# Altium project BTF16_2.PrjPcb (part 1 of 2)
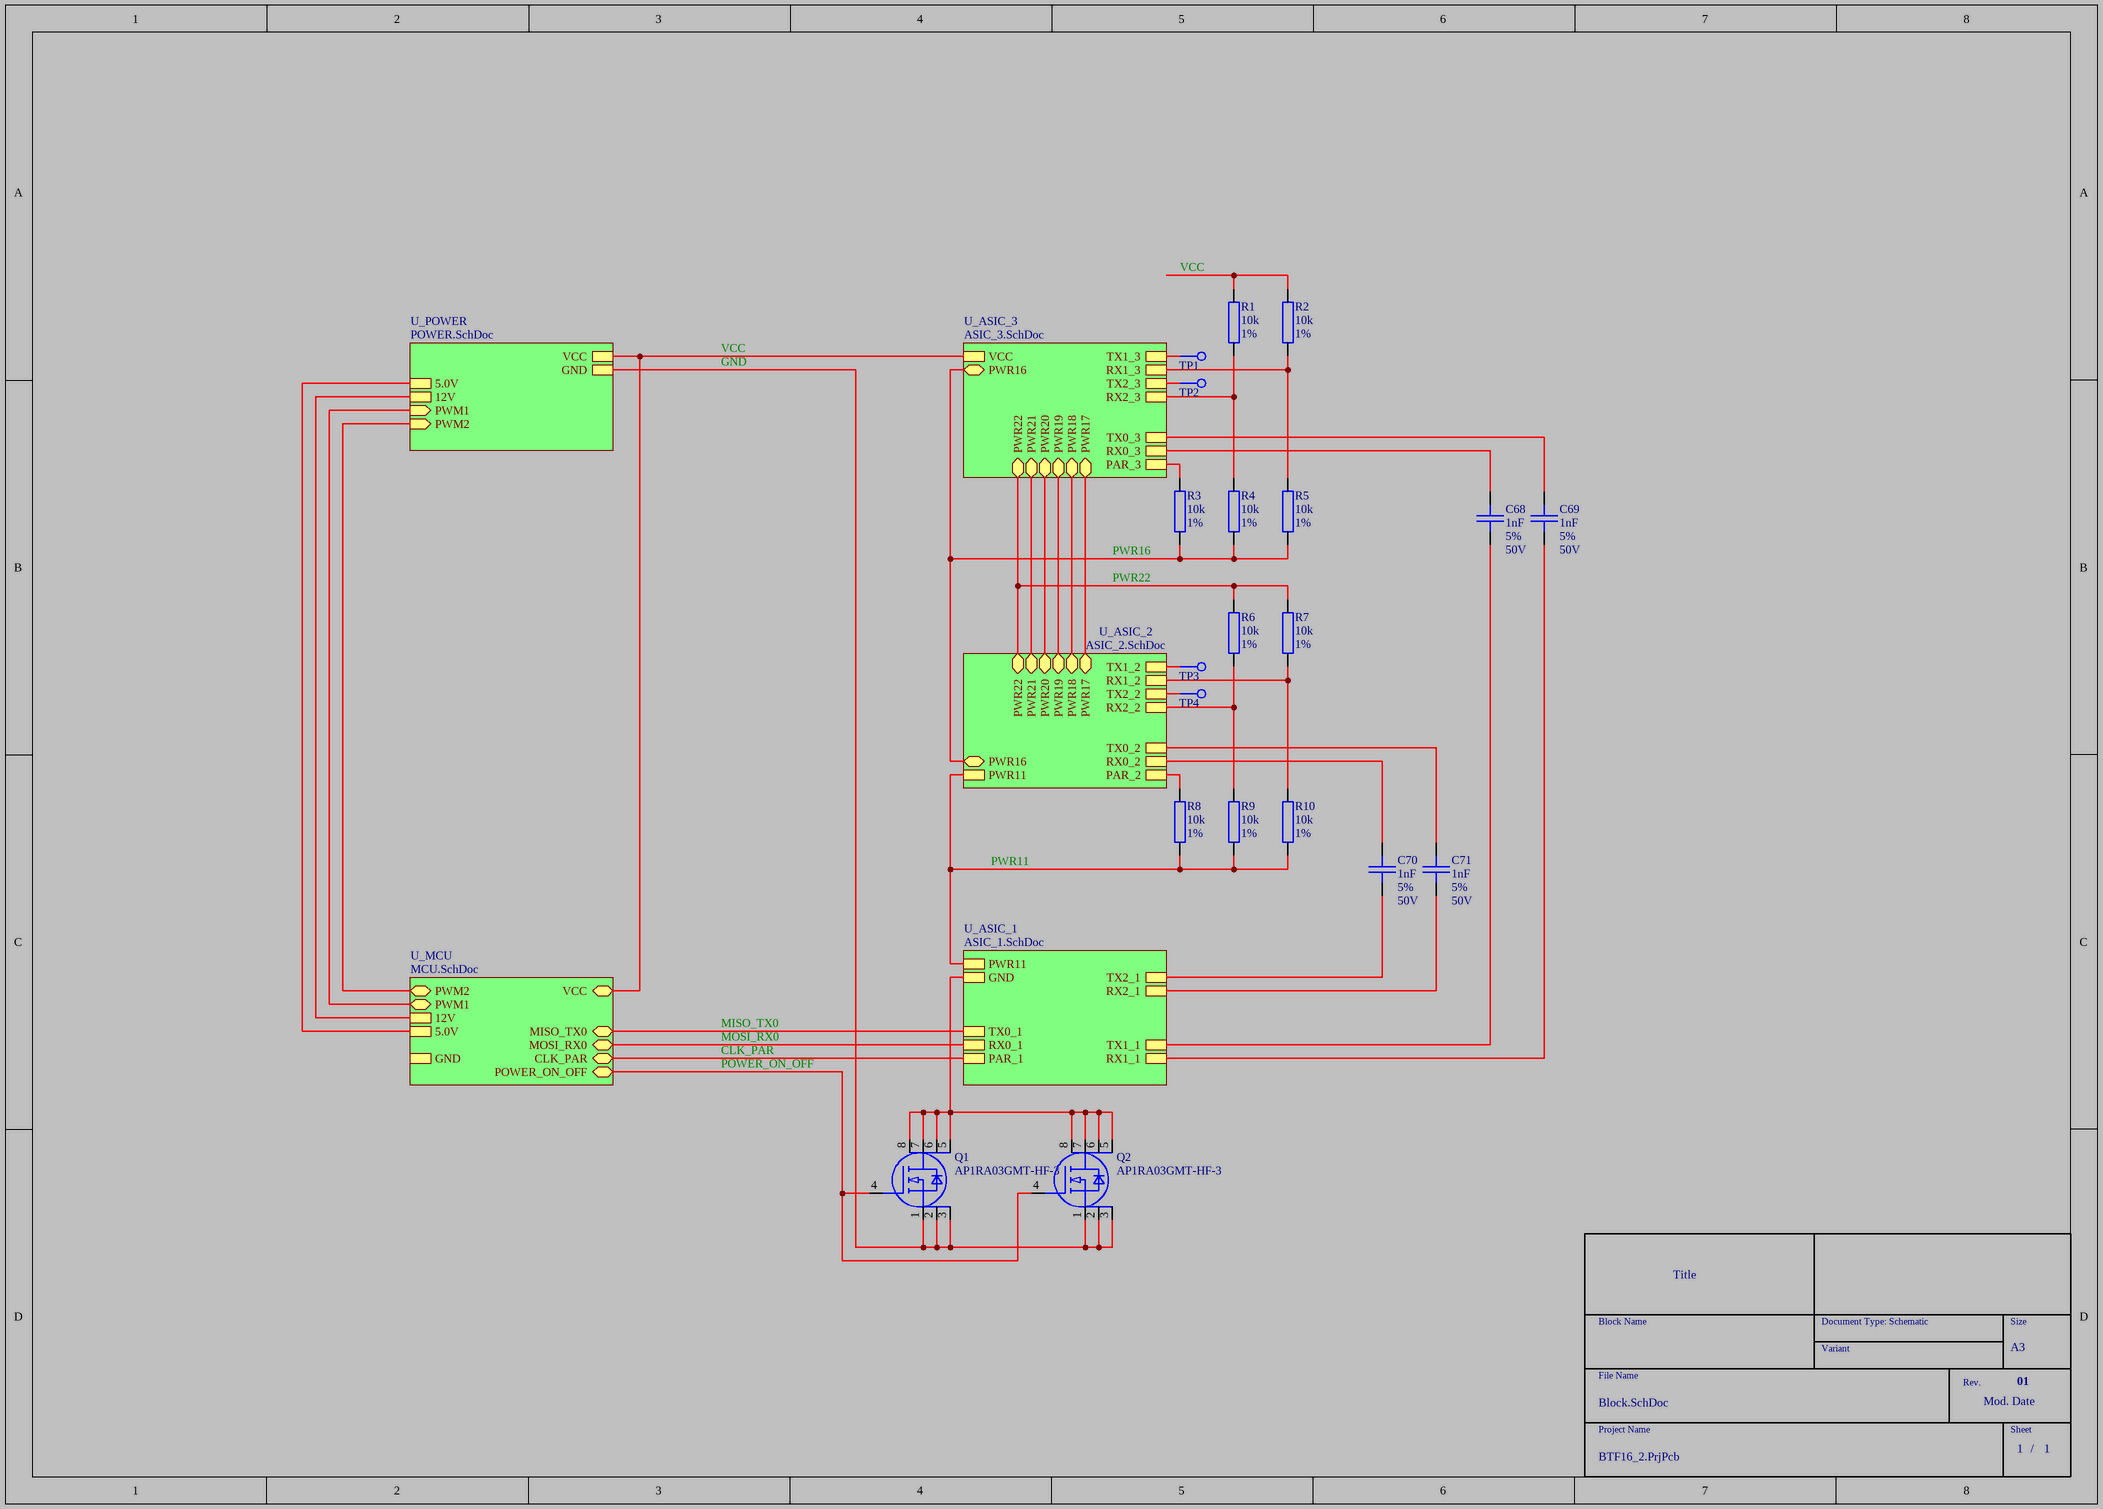
[diagram p0: Block.SchDoc]
6 sheets, 273 parts. Net scope: strictly hierarchical (ports join the sheet entries above them; power ports are local).
Board file: BTF16_2.PcbDoc
Sheets:
  Block.SchDoc
    U_MCU = MCU.SchDoc
    U_ASIC_1 = ASIC_1.SchDoc
    U_ASIC_2 = ASIC_2.SchDoc
    U_ASIC_3 = ASIC_3.SchDoc
    U_POWER = POWER.SchDoc

## Sheet Block.SchDoc: Title
size A3; Date: Date; CompanyName: Integrated Micro-Electronics Bulgaria; Organization: Design & Development Department; Address1: Drawing Type; Address2: Address 1; Address3: Address 2; Address4: Address 3; DocumentNumber: 730xxx; Revision: 01; SheetNumber: 1; SheetTotal: 1; PageSetup: Record=PageOptions|CenterHorizontal=True|CenterVertical=True|PrintScale=0.70|XCorrection=1.00|YCorrection=1.00|PrintKind=2|BorderSize=5000000|LeftOffset=0|BottomOffset=0|Orientation=2|PaperLength=1000|PaperWidth=1000|Scale=100|PaperSource=7|PrintQuality=-4|MediaType=1|DitherType=10|PaperKind=A4|PrintScaleMode=1; SheetSize: A3; Time: Time; ModifiedDate: Mod. Date

### Parts
C68  DB_VALUE: 1nF  DB_TOLERANCE: 5%  DB_VOLTAGE: 50V  [SMD_0603_CAPC1608X95N]  (hidden comment: C)
C69  DB_VALUE: 1nF  DB_TOLERANCE: 5%  DB_VOLTAGE: 50V  [SMD_0603_CAPC1608X95N]  (hidden comment: C)
C70  DB_VALUE: 1nF  DB_TOLERANCE: 5%  DB_VOLTAGE: 50V  [SMD_0603_CAPC1608X95N]  (hidden comment: C)
C71  DB_VALUE: 1nF  DB_TOLERANCE: 5%  DB_VOLTAGE: 50V  [SMD_0603_CAPC1608X95N]  (hidden comment: C)
Q1  DB_VALUE: AP1RA03GMT-HF-3  [SMD_SOIC127P600X110-9AN]  (hidden comment: MOS_N_D1_S1S2S3G4D5D6D7D8)
Q2  DB_VALUE: AP1RA03GMT-HF-3  [SMD_SOIC127P600X110-9AN]  (hidden comment: MOS_N_D1_S1S2S3G4D5D6D7D8)
R1  DB_VALUE: 10k  DB_TOLERANCE: 1%  [SMD_0603_RESC1608X55N]  (hidden comment: R)
R2  DB_VALUE: 10k  DB_TOLERANCE: 1%  [SMD_0603_RESC1608X55N]  (hidden comment: R)
R3  DB_VALUE: 10k  DB_TOLERANCE: 1%  [SMD_0603_RESC1608X55N]  (hidden comment: R)
R4  DB_VALUE: 10k  DB_TOLERANCE: 1%  [SMD_0603_RESC1608X55N]  (hidden comment: R)
R5  DB_VALUE: 10k  DB_TOLERANCE: 1%  [SMD_0603_RESC1608X55N]  (hidden comment: R)
R6  DB_VALUE: 10k  DB_TOLERANCE: 1%  [SMD_0603_RESC1608X55N]  (hidden comment: R)
R7  DB_VALUE: 10k  DB_TOLERANCE: 1%  [SMD_0603_RESC1608X55N]  (hidden comment: R)
R8  DB_VALUE: 10k  DB_TOLERANCE: 1%  [SMD_0603_RESC1608X55N]  (hidden comment: R)
R9  DB_VALUE: 10k  DB_TOLERANCE: 1%  [SMD_0603_RESC1608X55N]  (hidden comment: R)
R10  DB_VALUE: 10k  DB_TOLERANCE: 1%  [SMD_0603_RESC1608X55N]  (hidden comment: R)
TP1  TEST_POINT_1  [SMD_TP_100-254]  (value not drawn)
TP2  TEST_POINT_1  [SMD_TP_100-254]  (value not drawn)
TP3  TEST_POINT_1  [SMD_TP_100-254]  (value not drawn)
TP4  TEST_POINT_1  [SMD_TP_100-254]  (value not drawn)

### Sub-sheets
U_ASIC_1 = ASIC_1.SchDoc: PWR11, GND, PAR_1, TX0_1, RX0_1, TX1_1, RX1_1, TX2_1, RX2_1
U_ASIC_2 = ASIC_2.SchDoc: PWR11, PAR_2, TX0_2, RX0_2, TX1_2, RX1_2, TX2_2, RX2_2, PWR16, PWR22, PWR17, PWR18, PWR19, PWR20, PWR21
U_ASIC_3 = ASIC_3.SchDoc: VCC, PAR_3, TX0_3, RX0_3, TX1_3, RX1_3, TX2_3, RX2_3, PWR16, PWR17, PWR18, PWR19, PWR20, PWR21, PWR22
U_MCU = MCU.SchDoc: GND, 12V, 5.0V, MOSI_RX0, MISO_TX0, CLK_PAR, POWER_ON_OFF, PWM1, PWM2, VCC
U_POWER = POWER.SchDoc: VCC, GND, 5.0V, 12V, PWM1 (in), PWM2 (in)

### Nets
GND: Q1.1(S) Q1.2(S) Q1.3(S) Q2.1(S) Q2.2(S) Q2.3(S) ; sheet U_POWER/GND
5.0V: sheet U_MCU/5.0V, sheet U_POWER/5.0V
12V: sheet U_MCU/12V, sheet U_POWER/12V
CLK_PAR: sheet U_MCU/CLK_PAR, sheet U_ASIC_1/PAR_1
GND: Q1.5(D) Q1.6(D) Q1.7(D) Q1.8(D) Q2.5(D) Q2.6(D) Q2.7(D) Q2.8(D) ; sheet U_ASIC_1/GND  [a separate net that carries the same name]
MISO_TX0: sheet U_MCU/MISO_TX0, sheet U_ASIC_1/TX0_1
MOSI_RX0: sheet U_MCU/MOSI_RX0, sheet U_ASIC_1/RX0_1
PAR_2: R8.1 ; sheet U_ASIC_2/PAR_2
PAR_3: R3.1 ; sheet U_ASIC_3/PAR_3
POWER_ON_OFF: Q1.4(G) Q2.4(G) ; sheet U_MCU/POWER_ON_OFF
PWM1: sheet U_MCU/PWM1, sheet U_POWER/PWM1
PWM2: sheet U_MCU/PWM2, sheet U_POWER/PWM2
PWR11: R8.2 R9.2 R10.2 ; sheet U_ASIC_1/PWR11, sheet U_ASIC_2/PWR11
PWR16: R3.2 R4.2 R5.2 ; sheet U_ASIC_2/PWR16, sheet U_ASIC_3/PWR16
PWR17: sheet U_ASIC_2/PWR17, sheet U_ASIC_3/PWR17
PWR18: sheet U_ASIC_2/PWR18, sheet U_ASIC_3/PWR18
PWR19: sheet U_ASIC_2/PWR19, sheet U_ASIC_3/PWR19
PWR20: sheet U_ASIC_2/PWR20, sheet U_ASIC_3/PWR20
PWR21: sheet U_ASIC_2/PWR21, sheet U_ASIC_3/PWR21
PWR22: R6.2 R7.2 ; sheet U_ASIC_2/PWR22, sheet U_ASIC_3/PWR22
RX0_2: C70.1 ; sheet U_ASIC_2/RX0_2
RX0_3: C68.1 ; sheet U_ASIC_3/RX0_3
RX1_1: C69.2 ; sheet U_ASIC_1/RX1_1
RX1_2: R7.1 R10.1 ; sheet U_ASIC_2/RX1_2
RX1_3: R2.1 R5.1 ; sheet U_ASIC_3/RX1_3
RX2_1: C71.2 ; sheet U_ASIC_1/RX2_1
RX2_2: R6.1 R9.1 ; sheet U_ASIC_2/RX2_2
RX2_3: R1.1 R4.1 ; sheet U_ASIC_3/RX2_3
TX0_2: C71.1 ; sheet U_ASIC_2/TX0_2
TX0_3: C69.1 ; sheet U_ASIC_3/TX0_3
TX1_1: C68.2 ; sheet U_ASIC_1/TX1_1
TX1_2: TP3.1 ; sheet U_ASIC_2/TX1_2
TX1_3: TP1.1 ; sheet U_ASIC_3/TX1_3
TX2_1: C70.2 ; sheet U_ASIC_1/TX2_1
TX2_2: TP4.1 ; sheet U_ASIC_2/TX2_2
TX2_3: TP2.1 ; sheet U_ASIC_3/TX2_3
VCC: R1.2 R2.2 ; sheet U_MCU/VCC, sheet U_ASIC_3/VCC, sheet U_POWER/VCC

### Notes on the sheet
- Block Name
- Document Type: Schematic
- Size
- File Name
- Variant
- Rev.
- Project Name
- Sheet
- /

### Library data of the parts
C68-C71 = CAP000020649: DB_PART_TYPE: Ceramic_SMD\Open_Mode_X7R; DB_MANUFACTURER_PART: KEMET    C0603F102J5RAC; NOTE: <NOTE>; DB_T_RANGE: -55 to 125; DB_PACKAGE: 0603; DB_DESCRIPTION: C X7R 1nF 5% 50V 0603; DB_STATUS: NEW; DB_PART_NUMBER: CAP000020649; DB_PCB_DEVICE: SMD_0603_CAPC1608X95N; DB_APPROVED_ON: 09.10.2010; DB_DATASHEET: http://john.epiqdesign.com/projects/CIS_Datasheets/F3102_CE_Kemet.pdf?rev=92&sc=0
Q1 Q2 = TRA000001604: DB_PART_TYPE: MOSFET\N_Channel; DB_MANUFACTURER_PART: ADVANCED POWER ELECTRONICS CORP      AP1RA03GMT-HF-3; NOTE: <NOTE>; DB_T_RANGE: -55 to 150; DB_VOLTAGE: 30V; DB_CURRENT: 185A; DB_PACKAGE: PQFN 5x6B; DB_DESCRIPTION: TRANS AP1RA03GMT-HF-3 PQFN 5x6B; DB_APPROVED_BY: VSN; DB_STATUS: NEW; DB_PART_NUMBER: TRA000001604; DB_PCB_DEVICE: SMD_SOIC127P600X110-9AN; DB_APPROVED_ON: 07.05.2014 12:55:44; DB_DATASHEET: http://john.epiqdesign.com/projects/CIS_Datasheets/MOS_AP1RA03GMT-3.pdf?rev=1404&sc=0
R1-R10 = RES000008891: DB_PART_TYPE: SMD; DB_MANUFACTURER_PART: VISHAY    CRCW060310K0FKEA; NOTE: <NOTE>; DB_T_RANGE: -55 to 155; DB_POWER: 1/10W; DB_PACKAGE: 0603; DB_DESCRIPTION: R SMD 10k 1% 1/10W 0603; DB_CERTIFIED: AUT; DB_APPROVED_BY: VSN; DB_STATUS: NEW; R_BDS: R; DB_PART_NUMBER: RES000008891; DB_PCB_DEVICE: SMD_0603_RESC1608X55N; DB_APPROVED_ON: 25.01.2013 15:38:58; DB_DATASHEET: http://john.epiqdesign.com/projects/CIS_Datasheets/Standard_Thick_Film_Chip_Resistors_AEC_Vishay.pdf?rev=362&sc=0
TP1-TP4 = TPO000000001: DB_PART_TYPE: Test Point; DB_VALUE: 100_254; DB_DESCRIPTION: Test Point 100_254; DB_STATUS: NEW; DB_PART_NUMBER: TPO000000001; DB_DIAMETER: 100_254; DB_PCB_DEVICE: SMD_TP_100-254; DB_APPROVED_ON: 10.09.2010

## Sheet MCU.SchDoc: Title
size A3; Date: Date; CompanyName: Integrated Micro-Electronics Bulgaria; Organization: Design & Development Department; Address1: Drawing Type; Address2: Address 1; Address3: Address 2; Address4: Address 3; DocumentNumber: 730xxx; Revision: 01; SheetNumber: 1; SheetTotal: 1; PageSetup: Record=PageOptions|CenterHorizontal=True|CenterVertical=True|PrintScale=0.70|XCorrection=1.00|YCorrection=1.00|PrintKind=2|BorderSize=5000000|LeftOffset=0|BottomOffset=0|Orientation=2|PaperLength=1000|PaperWidth=1000|Scale=100|PaperSource=7|PrintQuality=-4|MediaType=1|DitherType=10|PaperKind=A4|PrintScaleMode=1; SheetSize: A3; Time: Time; ModifiedDate: Mod. Date
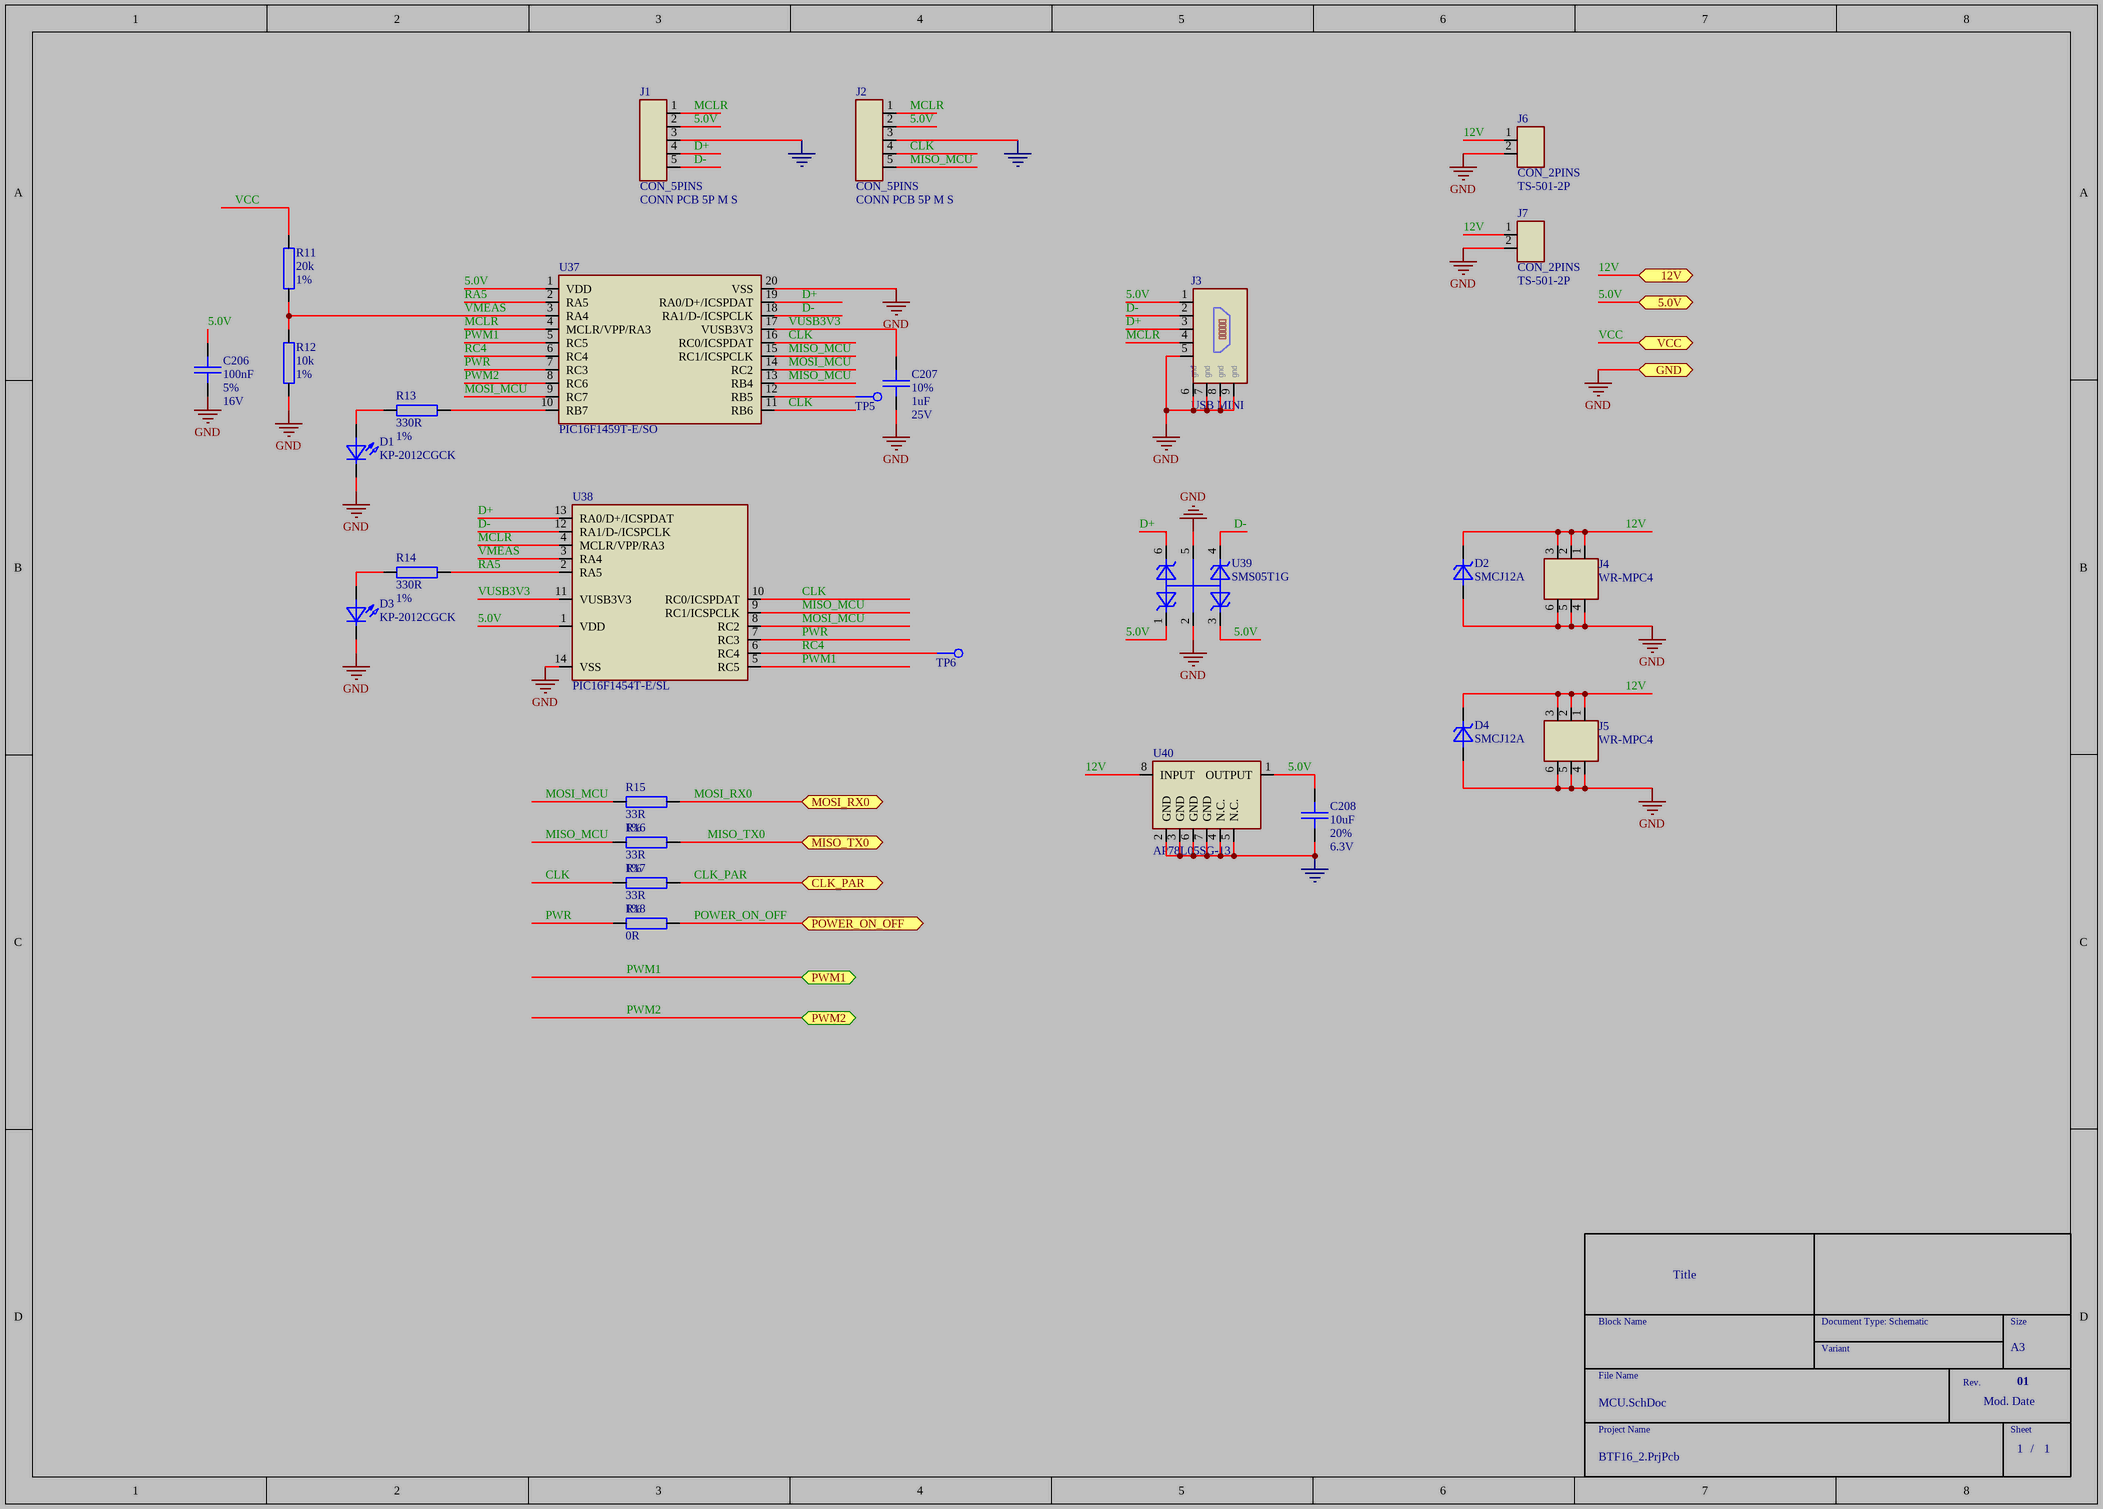
[diagram p1: MCU.SchDoc]

### Parts
C206  DB_VALUE: 100nF  DB_TOLERANCE: 5%  DB_VOLTAGE: 16V  [SMD_0603_CAPC1608X95N]  (hidden comment: C)
C207  DB_TOLERANCE: 10%  DB_VALUE: 1uF  DB_VOLTAGE: 25V  [SMD_0603_CAPC1608X80N]  (hidden comment: C)
C208  DB_VALUE: 10uF  DB_TOLERANCE: 20%  DB_VOLTAGE: 6.3V  [SMD_0603_CAPC1608X95N]  (hidden comment: C)
D1  DB_VALUE: KP-2012CGCK  [SMD_LED2012X100N]  (hidden comment: LED)
D2  DB_VALUE: SMCJ12A  [SMD_DO214AC_SMC]  (hidden comment: D_TVS_UNI)
D3  DB_VALUE: KP-2012CGCK  [SMD_LED2012X100N]  (hidden comment: LED)
D4  DB_VALUE: SMCJ12A  [SMD_DO214AC_SMC]  (hidden comment: D_TVS_UNI)
J1  CON_5PINS  DB_VALUE: CONN PCB 5P M S  [PTH_HDRV05W64P254_1X05]
J2  CON_5PINS  DB_VALUE: CONN PCB 5P M S  [PTH_HDRV05W64P254_1X05]
J3  DB_VALUE: USB MINI  [SMD_CON-CVILUX-CU04-SCM15B0]  (hidden comment: CON_USB_MINI_1)
J4  DB_VALUE: WR-MPC4  [PTH_CON_WR-MRC4-6P_S]  (hidden comment: CON_2ROWS_6PINS_1)
J5  DB_VALUE: WR-MPC4  [PTH_CON_WR-MRC4-6P_S]  (hidden comment: CON_2ROWS_6PINS_1)
J6  CON_2PINS  DB_VALUE: TS-501-2P  [PTH_HDRV02W11060P500_1X02]
J7  CON_2PINS  DB_VALUE: TS-501-2P  [PTH_HDRV02W11060P500_1X02]
R11  DB_VALUE: 20k  DB_TOLERANCE: 1%  [SMD_0603_RESC1608X55N]  (hidden comment: R)
R12  DB_VALUE: 10k  DB_TOLERANCE: 1%  [SMD_0603_RESC1608X55N]  (hidden comment: R)
R13  DB_VALUE: 330R  DB_TOLERANCE: 1%  [SMD_0603_RESC1608X55N]  (hidden comment: R)
R14  DB_VALUE: 330R  DB_TOLERANCE: 1%  [SMD_0603_RESC1608X55N]  (hidden comment: R)
R15  DB_VALUE: 33R  DB_TOLERANCE: 1%  [SMD_0201_RESC0603X26N]  (hidden comment: R)
R16  DB_VALUE: 33R  DB_TOLERANCE: 1%  [SMD_0201_RESC0603X26N]  (hidden comment: R)
R17  DB_VALUE: 33R  DB_TOLERANCE: 1%  [SMD_0201_RESC0603X26N]  (hidden comment: R)
R18  DB_VALUE: 0R  [SMD_0603_RESC1608X55N]  (hidden comment: R)
TP5  TEST_POINT_1  [SMD_TP_100-254]  (value not drawn)
TP6  TEST_POINT_1  [SMD_TP_100-254]  (value not drawn)
U37  DB_VALUE: PIC16F1459T-E/SO  [SMD_SOIC127P1030X265-20N]  (hidden comment: IC_PIC16F1459)
U38  DB_VALUE: PIC16F1454T-E/SL  [SMD_SOIC127P600X175-14N]  (hidden comment: IC_PIC16F1454TESL-SO14)
U39  DB_VALUE: SMS05T1G  [SMD_SOT457_SOT95P275X110-6N]  (hidden comment: D_TVS_QUAD_C1A2C3C4A5C6)
U40  DB_VALUE: AP78L05SG-13  [SMD_SOIC127P600X175-8N]  (hidden comment: IC_LM2931AD-5.0R2G_SO-8)

### Ports
5.0V, 12V, CLK_PAR, GND, MISO_TX0, MOSI_RX0, POWER_ON_OFF, PWM1, PWM2, VCC

### Nets
GND: C206.2 C207.2 C208.2 D1.1(C) D2.2(A) D3.1(C) D4.2(A) J1.3 J2.3 J3.5 J3.6 J3.7 J3.8 J3.9 J4.4 J4.5 J4.6 J5.4 J5.5 J5.6 J6.2 J7.2 R12.2 U37.20(VSS) U38.14(VSS) U39.2 U39.5 U40.2(GND) U40.3(GND) U40.4(N.C.) U40.5(N.C.) U40.6(GND) U40.7(GND) ; port GND
5.0V: C206.1 C208.1 J1.2 J2.2 J3.1 U37.1(VDD) U38.1(VDD) U39.1 U39.3 U40.1(OUTPUT) ; port 5.0V
12V: D2.1(C) D4.1(C) J4.1 J4.2 J4.3 J5.1 J5.2 J5.3 J6.1 J7.1 U40.8(INPUT) ; port 12V
CLK: J2.4 R17.1 U37.11(RB6) U37.16(RC0/ICSPDAT) U38.10(RC0/ICSPDAT)
CLK_PAR: R17.2 ; port CLK_PAR
D+: J1.4 J3.3 U37.19(RA0/D+/ICSPDAT) U38.13(RA0/D+/ICSPDAT) U39.6
D-: J1.5 J3.2 U37.18(RA1/D-/ICSPCLK) U38.12(RA1/D-/ICSPCLK) U39.4
MCLR: J1.1 J2.1 J3.4 U37.4(MCLR/VPP/RA3) U38.4(MCLR/VPP/RA3)
MISO_MCU: J2.5 R16.1 U37.13(RB4) U37.15(RC1/ICSPCLK) U38.9(RC1/ICSPCLK)
MISO_TX0: R16.2 ; port MISO_TX0
MOSI_MCU: R15.1 U37.9(RC7) U37.14(RC2) U38.8(RC2)
MOSI_RX0: R15.2 ; port MOSI_RX0
POWER_ON_OFF: R18.2 ; port POWER_ON_OFF
PWM1: U37.5(RC5) U38.5(RC5) ; port PWM1
PWM2: U37.8(RC6) ; port PWM2
PWR: R18.1 U37.7(RC3) U38.7(RC3)
RA5: R14.2 U37.2(RA5) U38.2(RA5)
RC4: TP6.1 U37.6(RC4) U38.6(RC4)
VCC: R11.1 ; port VCC
VMEAS: R11.2 R12.1 U37.3(RA4) U38.3(RA4)
VUSB3V3: C207.1 U37.17(VUSB3V3) U38.11(VUSB3V3)
NetD1_2: D1.2(A) R13.1
NetD3_2: D3.2(A) R14.1
NetR13_2: R13.2 U37.10(RB7)
NetTP5_1: TP5.1 U37.12(RB5)

### Notes on the sheet
- Block Name
- Document Type: Schematic
- Size
- File Name
- Variant
- Rev.
- Project Name
- Sheet
- /
- (in symbol CON000000048) gnd
- (in symbol CON_USB_MINI) gnd

### Library data of the parts
C206 = CAP000027134: DB_PART_TYPE: Ceramic_SMD\Standard_X7R; DB_MANUFACTURER_PART: KEMET    C0603C104J4RAC; NOTE: <NOTE>; DB_T_RANGE: -55 to 125; DB_PACKAGE: 0603; DB_DESCRIPTION: C X7R 100nF 5% 16V 0603; DB_STATUS: NEW; DB_PART_NUMBER: CAP000027134; DB_PCB_DEVICE: SMD_0603_CAPC1608X95N; DB_APPROVED_ON: 09.10.2010; DB_DATASHEET: http://john.epiqdesign.com/projects/CIS_Datasheets/F3102_CE_Kemet.pdf?rev=92&sc=0
C207 = CAP000047176: DB_MANUFACTURER_PART: TDK      CGA3E1X7R1E105KT; DB_PART_TYPE: Ceramic_SMD\Standard_X7R; NOTE: <NOTE>; DB_APPROVED_BY: VSN; DB_CERTIFIED: AUT; DB_DESCRIPTION: C X7R 1uF 10% 25V 0603; DB_PACKAGE: 0603; DB_STATUS: NEW; DB_T_RANGE: -55 to 125; DB_APPROVED_ON: 12.03.2012 08:41:25; DB_DATASHEET: http://john.epiqdesign.com/projects/CIS_Datasheets/CGA4_automotive_TDK_B11.pdf?rev=502&sc=0; DB_PART_NUMBER: CAP000047176; DB_PCB_DEVICE: SMD_0603_CAPC1608X80N
C208 = CAP000043646: DB_MANUFACTURER_PART: KEMET    C0603C106M9PAC; DB_PART_TYPE: Ceramic_SMD\Standard_X5R; NOTE: <NOTE>; DB_DESCRIPTION: C X5R 10uF 20% 6.3V 0603; DB_PACKAGE: 0603; DB_STATUS: NEW; DB_T_RANGE: -55 to 85; DB_PART_NUMBER: CAP000043646; DB_APPROVED_ON: 09.10.2010; DB_DATASHEET: http://john.epiqdesign.com/projects/CIS_Datasheets/F3102_CE_Kemet.pdf?rev=92&sc=0; DB_PCB_DEVICE: SMD_0603_CAPC1608X95N
D1 D3 = OPT000000096: DB_MANUFACTURER_PART: KINGBRIGHT       KP-2012CGCK; NOTE: <NOTE>; DB_T_RANGE: -40 to 85; DB_COLOUR: GREEN; DB_PACKAGE: 0805; DB_DESCRIPTION: LED GREEN 0805; DB_APPROVED_BY: VSN; DB_STATUS: NEW; DB_PART_NUMBER: OPT000000096; DB_PART_TYPE: LED; DB_PCB_DEVICE: SMD_LED2012X100N; DB_APPROVED_ON: 08.04.2014 09:22:12; DB_DATASHEET: http://john.epiqdesign.com/projects/CIS_Datasheets/LED_KP-2012CGCK_0805_GREEN.pdf?rev=1359&sc=0
D2 D4 = DDE000001725: DB_PART_TYPE: TVS; DB_MANUFACTURER_PART: Diodes        SMCJ12A; NOTE: <NOTE>; DB_T_RANGE: -55 to 150; DB_VOLTAGE: 12V; DB_CURRENT: 75A(Max); DB_PACKAGE: SMC; DB_DESCRIPTION: D SMCJ12A SMC; DB_STATUS: NEW; DB_PART_NUMBER: DDE000001725; DB_PCB_DEVICE: SMD_DO214AC_SMC; DB_APPROVED_ON: 09.10.2010
J1 J2 = CON000000006: DB_PART_TYPE: Connector; DB_MANUFACTURER_PART: W+P        143-12-005-00; NOTE: <NOTE>; DB_T_RANGE: -55 to 125; DB_PACKAGE: PTH; DB_DESCRIPTION: CONN PCB 5P M S 143-12-005-00; DB_APPROVED_BY: VSN; DB_STATUS: NEW; DB_PART_NUMBER: CON000000006; DB_PCB_DEVICE: PTH_HDRV05W64P254_1X05; DB_APPROVED_ON: 14.12.2010 10:22:07; DB_DATASHEET: http://john.epiqdesign.com/projects/CIS_Datasheets/143-12-005-00_W+P.pdf?rev=3&sc=0
J3 = CON000000048: DB_PART_TYPE: Connector; DB_MANUFACTURER_PART: CVILUX       CU04-SCM15B0-R0-LF; NOTE: <NOTE>; DB_PINS_NUMBER: 5; DB_PITCH: 0.8; DB_PACKAGE: SMD; DB_DESCRIPTION: CONN  PCB  5P  F  A  USB5 MINI SMD; DB_APPROVED_BY: VSN; DB_STATUS: NEW; DB_PART_NUMBER: CON000000048; DB_PCB_DEVICE: SMD_CON-CVILUX-CU04-SCM15B0; DB_APPROVED_ON: 02.05.2011 10:29:38; DB_DATASHEET: http://john.epiqdesign.com/projects/CIS_Datasheets/USB%20MINI_CVILUX.pdf?rev=249&sc=0
J4 J5 = CON000000279: DB_PART_TYPE: Connector; DB_MANUFACTURER_PART: WE        	649 006 211 22; DB_PINS_NUMBER: 6; DB_PITCH: 4.2mm; DB_T_RANGE: -40 to 105; DB_VOLTAGE: 600VAC; DB_CURRENT: 6 - 9A; DB_PACKAGE: PTH; DB_DESCRIPTION: CONN PCB 6P M S PTH; DB_APPROVED_BY: VSN; DB_STATUS: NEW; DB_PART_NUMBER: CON000000279; DB_PCB_DEVICE: PTH_CON_WR-MRC4-6P_S; DB_APPROVED_ON: 31.05.2014 08:51:24; DB_DATASHEET: http://john.epiqdesign.com/projects/CIS_Datasheets/CON_6490xx21122.pdf?rev=1438&sc=0
J6 J7 = CON000000055: DB_PART_TYPE: Connector; DB_MANUFACTURER_PART: HOW DER      TS-501-2P; NOTE: <NOTE>; DB_PINS_NUMBER: 2; DB_PITCH: 5mm; DB_VOLTAGE: 300VAC; DB_CURRENT: 10A; DB_PACKAGE: PTH; DB_DESCRIPTION: CONN PCB 2P; DB_APPROVED_BY: VSN; DB_STATUS: NEW; DB_PART_NUMBER: CON000000055; DB_PCB_DEVICE: PTH_HDRV02W11060P500_1X02; DB_APPROVED_ON: 25.08.2011 14:07:02; DB_DATASHEET: http://john.epiqdesign.com/projects/CIS_Datasheets/TS-501_HOW_DER.pdf?rev=399&sc=0
R11 = RES000006283: DB_PART_TYPE: SMD; DB_MANUFACTURER_PART: YAGEO    RC0603FR-0720K; NOTE: <NOTE>; DB_T_RANGE: -55 to 155; DB_POWER: 1/10W; DB_PACKAGE: 0603; DB_DESCRIPTION: R SMD 20K 1% 1/10W 0603; DB_CERTIFIED: AUT; DB_PRICE: 0.00063; DB_MOQ: 5000; DB_STATUS: NEW; R_BDS: R; DB_PART_NUMBER: RES000006283; DB_PCB_DEVICE: SMD_0603_RESC1608X55N; DB_PRICE_DATE: 2010-12-23; DB_APPROVED_ON: 09.10.2010; DB_DATASHEET: http://john.epiqdesign.com/projects/CIS_Datasheets/PYu-RC0603_51_RoHS_L_4_YAGEO.pdf?rev=138&sc=0
R12 = RES000008891: as R1 on sheet Block; R_BDS: R; DB_PART_NUMBER: RES000008891; DB_PCB_DEVICE: SMD_0603_RESC1608X55N; DB_APPROVED_ON: 25.01.2013 15:38:58; DB_DATASHEET: http://john.epiqdesign.com/projects/CIS_Datasheets/Standard_Thick_Film_Chip_Resistors_AEC_Vishay.pdf?rev=362&sc=0
R13 R14 = RES000006240: DB_PART_TYPE: SMD; DB_MANUFACTURER_PART: YAGEO    RC0603FR-07330R; NOTE: <NOTE>; DB_T_RANGE: -55 to 155; DB_POWER: 1/10W; DB_PACKAGE: 0603; DB_DESCRIPTION: R SMD 330R 1% 1/10W 0603; DB_CERTIFIED: AUT; DB_PRICE: 0.00063; DB_MOQ: 5000; DB_STATUS: NEW; R_BDS: R; DB_PART_NUMBER: RES000006240; DB_PCB_DEVICE: SMD_0603_RESC1608X55N; DB_PRICE_DATE: 2010-12-23; DB_APPROVED_ON: 09.10.2010; DB_DATASHEET: http://john.epiqdesign.com/projects/CIS_Datasheets/PYu-RC0603_51_RoHS_L_4_YAGEO.pdf?rev=138&sc=0
R15-R17 = RES000005550: DB_PART_TYPE: SMD; DB_MANUFACTURER_PART: YAGEO    RC0201FR-0733R; NOTE: <NOTE>; DB_T_RANGE: -55 to 125; DB_POWER: 1/20W; DB_PACKAGE: 0201; DB_DESCRIPTION: R SMD 33R 1% 1/20W 0201; DB_CERTIFIED: AUT; DB_PRICE: 0.00404; DB_STATUS: NEW; R_BDS: R; DB_PART_NUMBER: RES000005550; DB_PCB_DEVICE: SMD_0201_RESC0603X26N; DB_PRICE_DATE: 07-02-2013; DB_APPROVED_ON: 09.10.2010; DB_DATASHEET: http://john.epiqdesign.com/projects/CIS_Datasheets/PYu-RC0201_51_RoHS_L_7_YAGEO.pdf?rev=138&sc=0
R18 = RES000008926: DB_PART_TYPE: SMD; DB_MANUFACTURER_PART: YAGEO    AC0603FR-070RL; NOTE: <NOTE>; DB_TOLERANCE: 1%; DB_T_RANGE: -55 to 155; DB_POWER: 1/10W; DB_PACKAGE: 0603; DB_DESCRIPTION: R SMD 0R 1% 1/10W 0603; DB_CERTIFIED: AUT; DB_APPROVED_BY: VSN; DB_STATUS: NEW; R_BDS: R; DB_PART_NUMBER: RES000008926; DB_PCB_DEVICE: SMD_0603_RESC1608X55N; DB_APPROVED_ON: 21.05.2013 09:19:53; DB_DATASHEET: http://john.epiqdesign.com/projects/CIS_Datasheets/RES_AC_YAGEO.pdf?rev=263&sc=0
TP5 TP6 = TPO000000001: as TP1 on sheet Block; DB_PART_NUMBER: TPO000000001; DB_DIAMETER: 100_254; DB_PCB_DEVICE: SMD_TP_100-254; DB_APPROVED_ON: 10.09.2010
U37 = MCU000000108: DB_PART_TYPE: Microchip; DB_MANUFACTURER_PART: MICROCHIP        PIC16F1459T-E/SO; DB_T_RANGE: -40 to 125; DB_PACKAGE: SOIC-20; DB_DESCRIPTION: IC  PIC16F1459T-E/SO  SOIC-20; DB_APPROVED_BY: VSN; DB_STATUS: NEW; DB_PART_NUMBER: MCU000000108; DB_PCB_DEVICE: SMD_SOIC127P1030X265-20N; DB_APPROVED_ON: 16.01.2015 12:54:38; DB_DATASHEET: http://john.epiqdesign.com/projects/CIS_Datasheets/IC_PIC16F1459.pdf?rev=1594&sc=0
U38 = MCU000000093: DB_PART_TYPE: Microchip; DB_MANUFACTURER_PART: MICROCHIP       PIC16F1454T-E/SL; DB_T_RANGE: -40 to 125; DB_PACKAGE: SOIC-14; DB_DESCRIPTION: IC PIC16F1454T-E/SL  SOIC-14; DB_APPROVED_BY: VSN; DB_STATUS: NEW; DB_PART_NUMBER: MCU000000093; DB_PCB_DEVICE: SMD_SOIC127P600X175-14N; DB_APPROVED_ON: 24.03.2014 10:24:48; DB_DATASHEET: http://john.epiqdesign.com/projects/CIS_Datasheets/IC_PIC16F1454.pdf?rev=1324&sc=0
U39 = DDE000002846: DB_PART_TYPE: ESD protection; DB_MANUFACTURER_PART: ON SEMICONDUCTOR        SMS05T1G; DB_T_RANGE: -55 to 150; DB_VOLTAGE: 5V; DB_PACKAGE: SC-74; DB_DESCRIPTION: D SMS05T1G SC-74; DB_APPROVED_BY: VSN; DB_STATUS: NEW; DB_PART_NUMBER: DDE000002846; DB_PCB_DEVICE: SMD_SOT457_SOT95P275X110-6N; DB_APPROVED_ON: 24.03.2014 10:22:08; DB_DATASHEET: http://john.epiqdesign.com/projects/CIS_Datasheets/IC_SMS05T1-D.pdf?rev=1323&sc=0
U40 = PSU000000125: DB_PART_TYPE: Linear Voltage Regulator; DB_MANUFACTURER_PART: DIODES        AP78L05SG-13; DB_T_RANGE: -40 to 125; DB_VOLTAGE: 5V; DB_CURRENT: 100mA; DB_PACKAGE: SOIC-8; DB_DESCRIPTION: IC AP78L05SG-13 SOIC-8; DB_APPROVED_BY: VSN; DB_STATUS: NEW; DB_PART_NUMBER: PSU000000125; DB_PCB_DEVICE: SMD_SOIC127P600X175-8N; DB_APPROVED_ON: 07.05.2014 12:58:07; DB_DATASHEET: http://john.epiqdesign.com/projects/CIS_Datasheets/IC_AP78LXX.pdf?rev=1405&sc=0

## Sheet ASIC_1.SchDoc: Title
size A2; Date: Date; CompanyName: Integrated Micro-Electronics Bulgaria; Organization: Design & Development Department; Address1: Drawing Type; Address2: Address 1; Address3: Address 2; Address4: Address 3; DocumentNumber: 730xxx; Revision: 01; SheetNumber: 1; SheetTotal: 1; PageSetup: Record=PageOptions|CenterHorizontal=True|CenterVertical=True|PrintScale=0.70|XCorrection=1.00|YCorrection=1.00|PrintKind=2|BorderSize=5000000|LeftOffset=0|BottomOffset=0|Orientation=2|PaperLength=1000|PaperWidth=1000|Scale=100|PaperSource=7|PrintQuality=-4|MediaType=1|DitherType=10|PaperKind=A4|PrintScaleMode=1; SheetSize: A3; Time: Time; ModifiedDate: Mod. Date
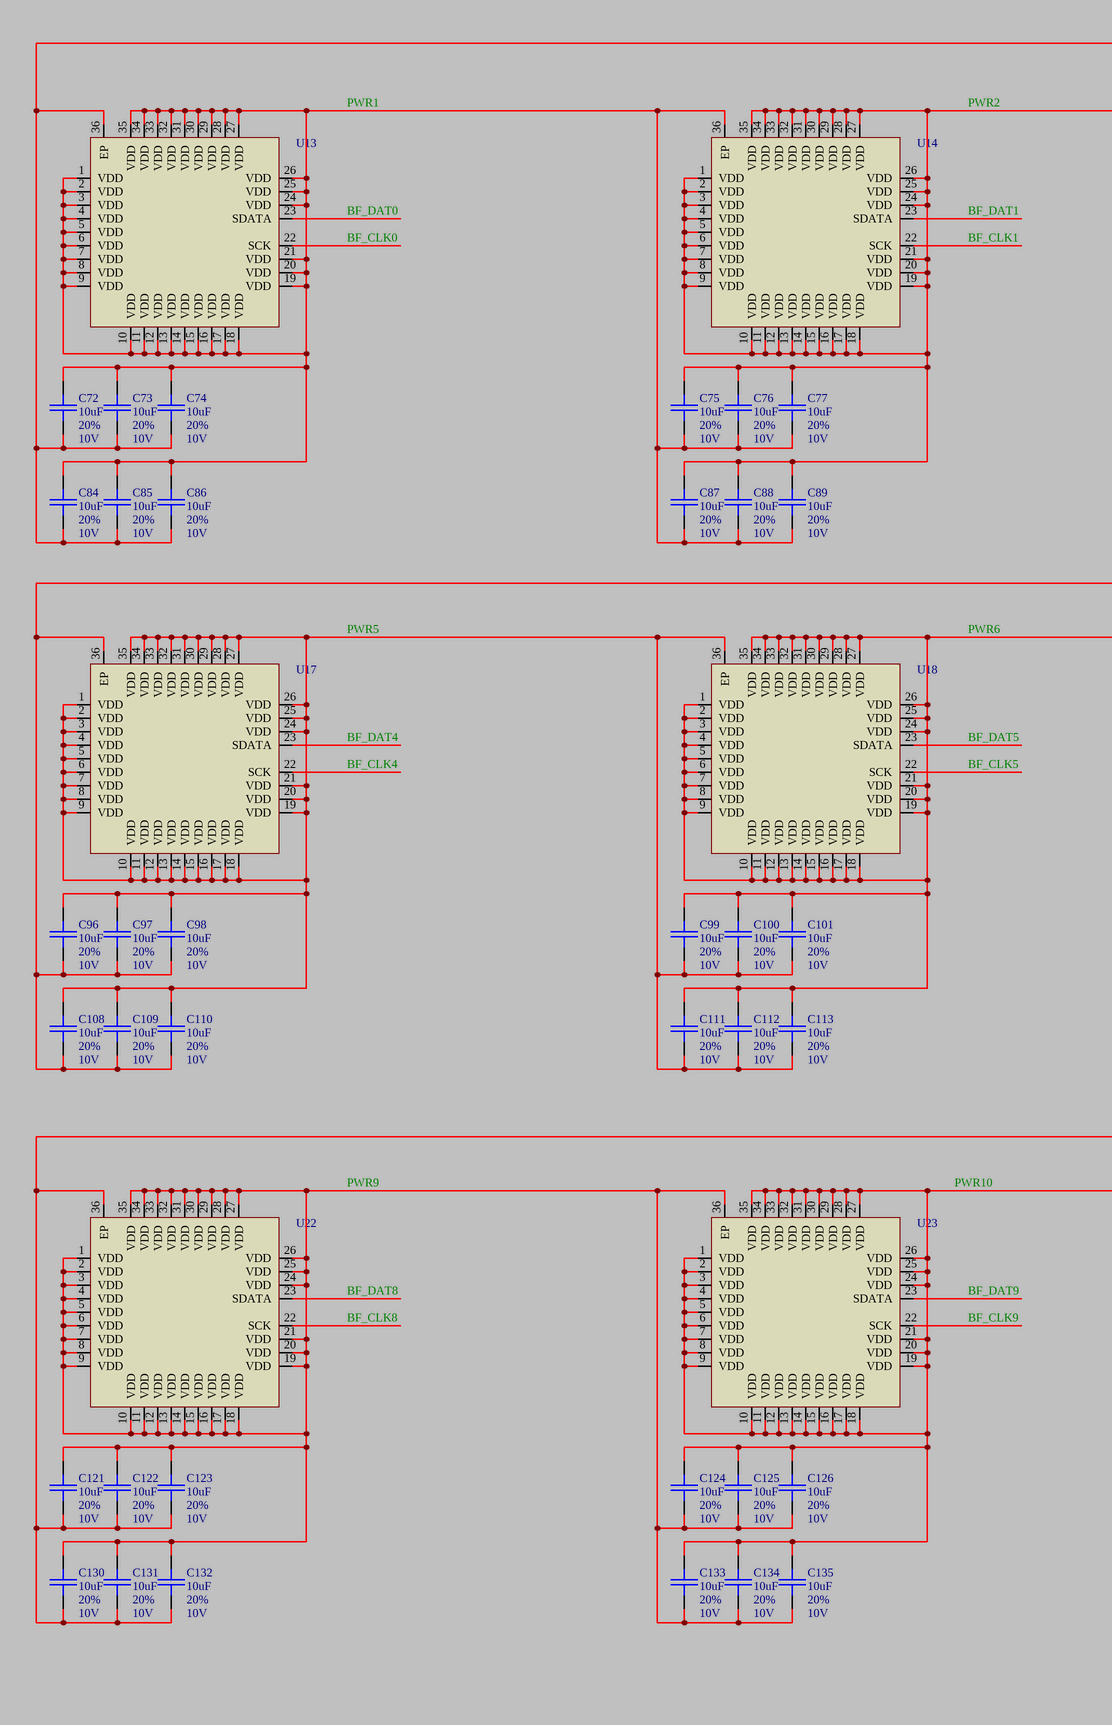
[diagram p2: ASIC_1.SchDoc, left]
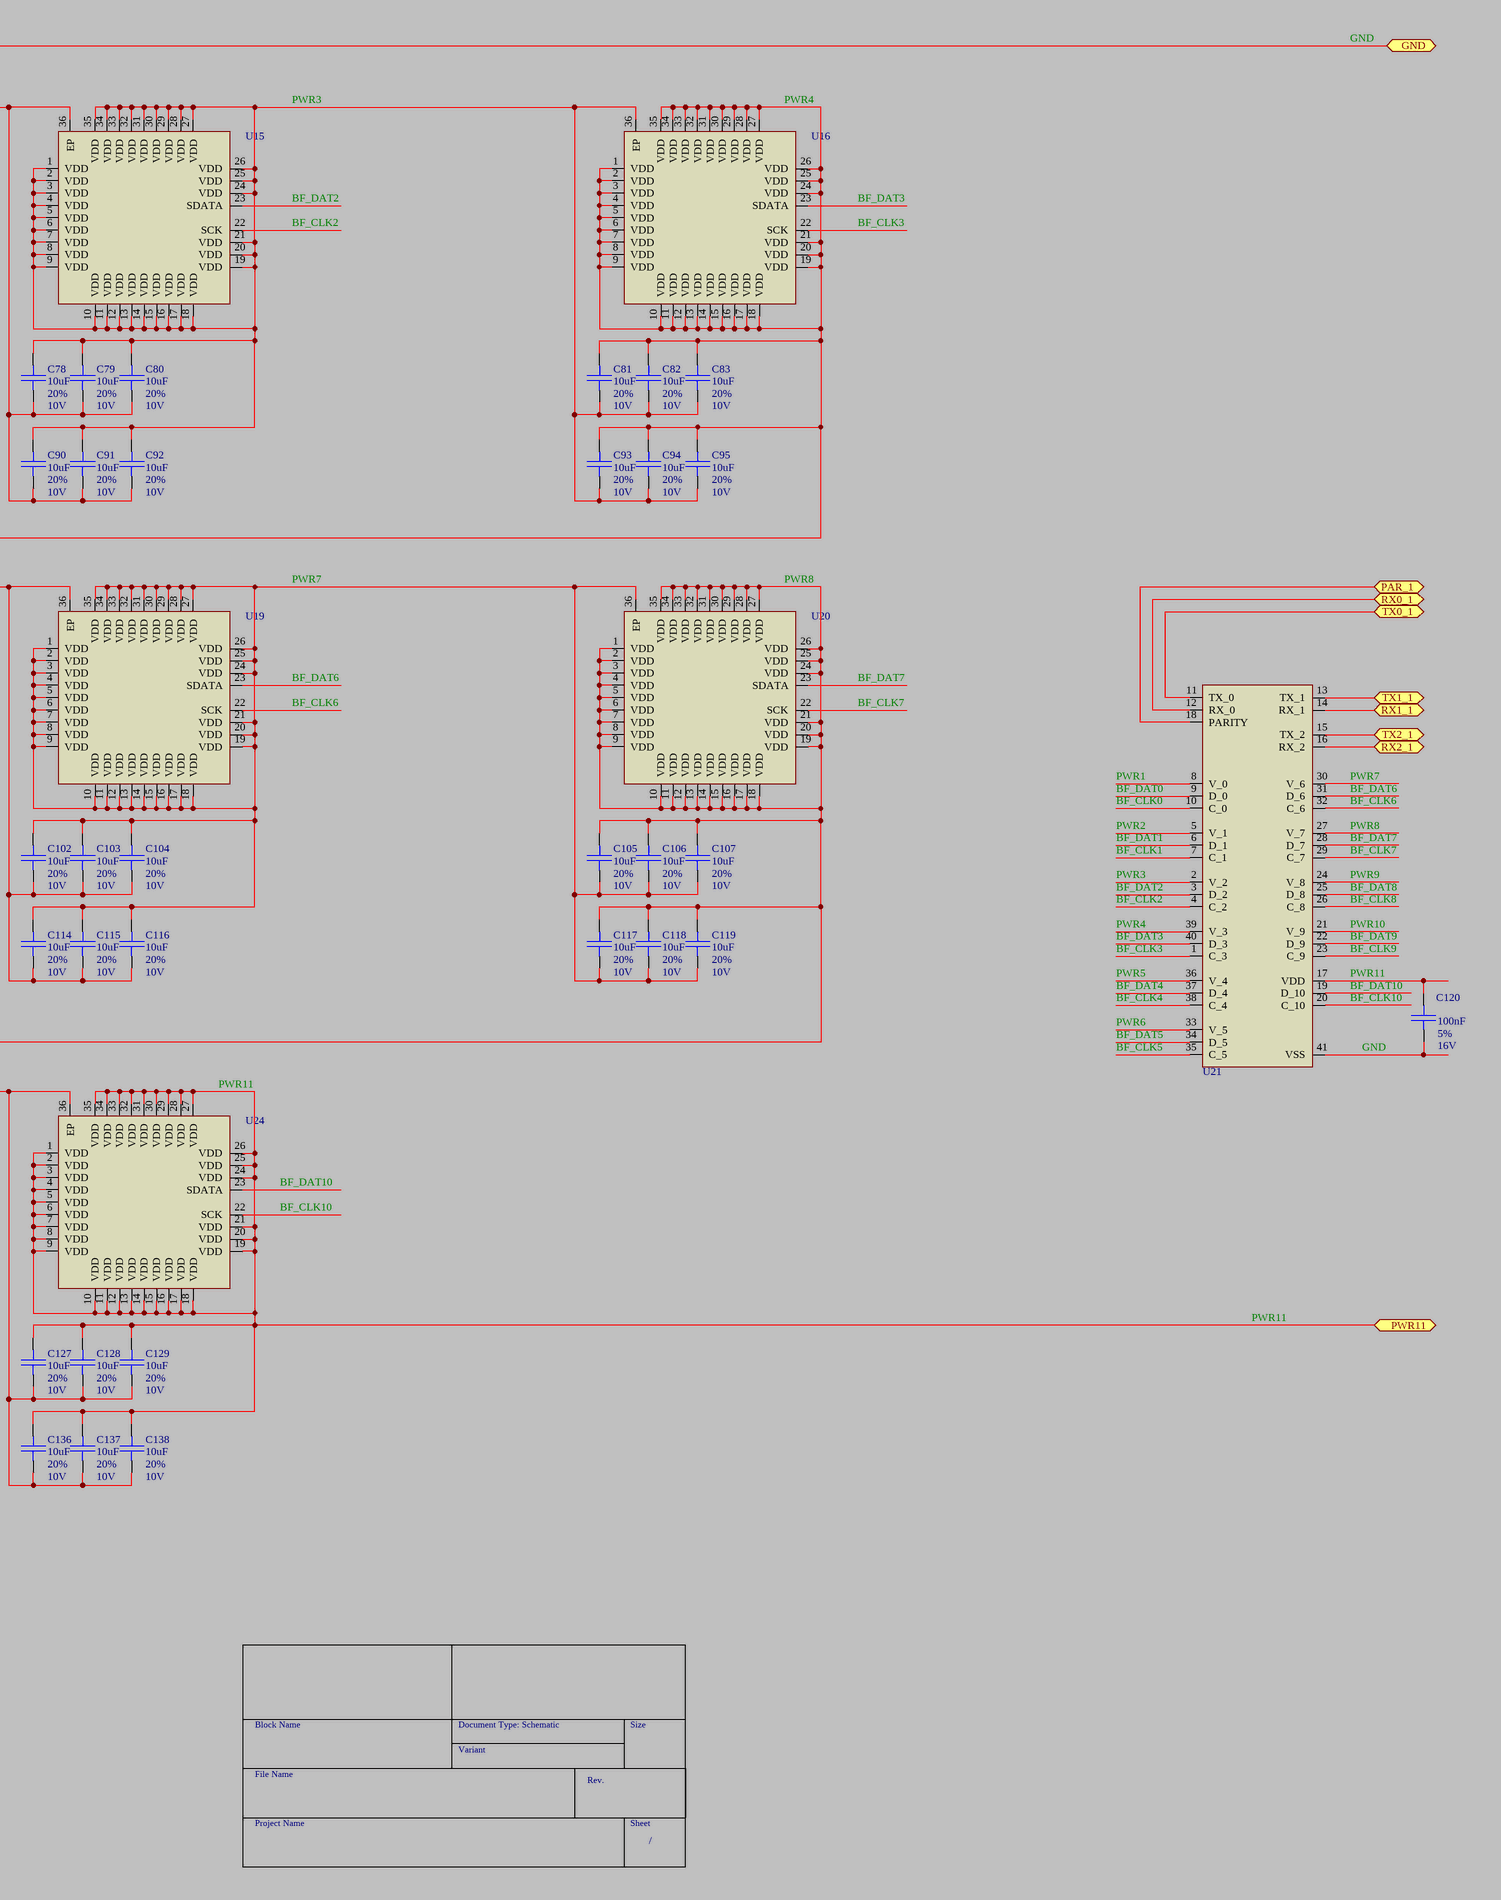
[diagram p3: ASIC_1.SchDoc, right]

### Parts
C72  DB_VALUE: 10uF  DB_TOLERANCE: 20%  DB_VOLTAGE: 10V  [SMD_0402_CAPC1005X70N]  (hidden comment: C)
C73  DB_VALUE: 10uF  DB_TOLERANCE: 20%  DB_VOLTAGE: 10V  [SMD_0402_CAPC1005X70N]  (hidden comment: C)
C74  DB_VALUE: 10uF  DB_TOLERANCE: 20%  DB_VOLTAGE: 10V  [SMD_0402_CAPC1005X70N]  (hidden comment: C)
C75  DB_VALUE: 10uF  DB_TOLERANCE: 20%  DB_VOLTAGE: 10V  [SMD_0402_CAPC1005X70N]  (hidden comment: C)
C76  DB_VALUE: 10uF  DB_TOLERANCE: 20%  DB_VOLTAGE: 10V  [SMD_0402_CAPC1005X70N]  (hidden comment: C)
C77  DB_VALUE: 10uF  DB_TOLERANCE: 20%  DB_VOLTAGE: 10V  [SMD_0402_CAPC1005X70N]  (hidden comment: C)
C78  DB_VALUE: 10uF  DB_TOLERANCE: 20%  DB_VOLTAGE: 10V  [SMD_0402_CAPC1005X70N]  (hidden comment: C)
C79  DB_VALUE: 10uF  DB_TOLERANCE: 20%  DB_VOLTAGE: 10V  [SMD_0402_CAPC1005X70N]  (hidden comment: C)
C80  DB_VALUE: 10uF  DB_TOLERANCE: 20%  DB_VOLTAGE: 10V  [SMD_0402_CAPC1005X70N]  (hidden comment: C)
C81  DB_VALUE: 10uF  DB_TOLERANCE: 20%  DB_VOLTAGE: 10V  [SMD_0402_CAPC1005X70N]  (hidden comment: C)
C82  DB_VALUE: 10uF  DB_TOLERANCE: 20%  DB_VOLTAGE: 10V  [SMD_0402_CAPC1005X70N]  (hidden comment: C)
C83  DB_VALUE: 10uF  DB_TOLERANCE: 20%  DB_VOLTAGE: 10V  [SMD_0402_CAPC1005X70N]  (hidden comment: C)
C84  DB_VALUE: 10uF  DB_TOLERANCE: 20%  DB_VOLTAGE: 10V  [SMD_0402_CAPC1005X70N]  (hidden comment: C)
C85  DB_VALUE: 10uF  DB_TOLERANCE: 20%  DB_VOLTAGE: 10V  [SMD_0402_CAPC1005X70N]  (hidden comment: C)
C86  DB_VALUE: 10uF  DB_TOLERANCE: 20%  DB_VOLTAGE: 10V  [SMD_0402_CAPC1005X70N]  (hidden comment: C)
C87  DB_VALUE: 10uF  DB_TOLERANCE: 20%  DB_VOLTAGE: 10V  [SMD_0402_CAPC1005X70N]  (hidden comment: C)
C88  DB_VALUE: 10uF  DB_TOLERANCE: 20%  DB_VOLTAGE: 10V  [SMD_0402_CAPC1005X70N]  (hidden comment: C)
C89  DB_VALUE: 10uF  DB_TOLERANCE: 20%  DB_VOLTAGE: 10V  [SMD_0402_CAPC1005X70N]  (hidden comment: C)
C90  DB_VALUE: 10uF  DB_TOLERANCE: 20%  DB_VOLTAGE: 10V  [SMD_0402_CAPC1005X70N]  (hidden comment: C)
C91  DB_VALUE: 10uF  DB_TOLERANCE: 20%  DB_VOLTAGE: 10V  [SMD_0402_CAPC1005X70N]  (hidden comment: C)
C92  DB_VALUE: 10uF  DB_TOLERANCE: 20%  DB_VOLTAGE: 10V  [SMD_0402_CAPC1005X70N]  (hidden comment: C)
C93  DB_VALUE: 10uF  DB_TOLERANCE: 20%  DB_VOLTAGE: 10V  [SMD_0402_CAPC1005X70N]  (hidden comment: C)
C94  DB_VALUE: 10uF  DB_TOLERANCE: 20%  DB_VOLTAGE: 10V  [SMD_0402_CAPC1005X70N]  (hidden comment: C)
C95  DB_VALUE: 10uF  DB_TOLERANCE: 20%  DB_VOLTAGE: 10V  [SMD_0402_CAPC1005X70N]  (hidden comment: C)
C96  DB_VALUE: 10uF  DB_TOLERANCE: 20%  DB_VOLTAGE: 10V  [SMD_0402_CAPC1005X70N]  (hidden comment: C)
C97  DB_VALUE: 10uF  DB_TOLERANCE: 20%  DB_VOLTAGE: 10V  [SMD_0402_CAPC1005X70N]  (hidden comment: C)
C98  DB_VALUE: 10uF  DB_TOLERANCE: 20%  DB_VOLTAGE: 10V  [SMD_0402_CAPC1005X70N]  (hidden comment: C)
C99  DB_VALUE: 10uF  DB_TOLERANCE: 20%  DB_VOLTAGE: 10V  [SMD_0402_CAPC1005X70N]  (hidden comment: C)
C100  DB_VALUE: 10uF  DB_TOLERANCE: 20%  DB_VOLTAGE: 10V  [SMD_0402_CAPC1005X70N]  (hidden comment: C)
C101  DB_VALUE: 10uF  DB_TOLERANCE: 20%  DB_VOLTAGE: 10V  [SMD_0402_CAPC1005X70N]  (hidden comment: C)
C102  DB_VALUE: 10uF  DB_TOLERANCE: 20%  DB_VOLTAGE: 10V  [SMD_0402_CAPC1005X70N]  (hidden comment: C)
C103  DB_VALUE: 10uF  DB_TOLERANCE: 20%  DB_VOLTAGE: 10V  [SMD_0402_CAPC1005X70N]  (hidden comment: C)
C104  DB_VALUE: 10uF  DB_TOLERANCE: 20%  DB_VOLTAGE: 10V  [SMD_0402_CAPC1005X70N]  (hidden comment: C)
C105  DB_VALUE: 10uF  DB_TOLERANCE: 20%  DB_VOLTAGE: 10V  [SMD_0402_CAPC1005X70N]  (hidden comment: C)
C106  DB_VALUE: 10uF  DB_TOLERANCE: 20%  DB_VOLTAGE: 10V  [SMD_0402_CAPC1005X70N]  (hidden comment: C)
C107  DB_VALUE: 10uF  DB_TOLERANCE: 20%  DB_VOLTAGE: 10V  [SMD_0402_CAPC1005X70N]  (hidden comment: C)
C108  DB_VALUE: 10uF  DB_TOLERANCE: 20%  DB_VOLTAGE: 10V  [SMD_0402_CAPC1005X70N]  (hidden comment: C)
C109  DB_VALUE: 10uF  DB_TOLERANCE: 20%  DB_VOLTAGE: 10V  [SMD_0402_CAPC1005X70N]  (hidden comment: C)
C110  DB_VALUE: 10uF  DB_TOLERANCE: 20%  DB_VOLTAGE: 10V  [SMD_0402_CAPC1005X70N]  (hidden comment: C)
C111  DB_VALUE: 10uF  DB_TOLERANCE: 20%  DB_VOLTAGE: 10V  [SMD_0402_CAPC1005X70N]  (hidden comment: C)
C112  DB_VALUE: 10uF  DB_TOLERANCE: 20%  DB_VOLTAGE: 10V  [SMD_0402_CAPC1005X70N]  (hidden comment: C)
C113  DB_VALUE: 10uF  DB_TOLERANCE: 20%  DB_VOLTAGE: 10V  [SMD_0402_CAPC1005X70N]  (hidden comment: C)
C114  DB_VALUE: 10uF  DB_TOLERANCE: 20%  DB_VOLTAGE: 10V  [SMD_0402_CAPC1005X70N]  (hidden comment: C)
C115  DB_VALUE: 10uF  DB_TOLERANCE: 20%  DB_VOLTAGE: 10V  [SMD_0402_CAPC1005X70N]  (hidden comment: C)
C116  DB_VALUE: 10uF  DB_TOLERANCE: 20%  DB_VOLTAGE: 10V  [SMD_0402_CAPC1005X70N]  (hidden comment: C)
C117  DB_VALUE: 10uF  DB_TOLERANCE: 20%  DB_VOLTAGE: 10V  [SMD_0402_CAPC1005X70N]  (hidden comment: C)
C118  DB_VALUE: 10uF  DB_TOLERANCE: 20%  DB_VOLTAGE: 10V  [SMD_0402_CAPC1005X70N]  (hidden comment: C)
C119  DB_VALUE: 10uF  DB_TOLERANCE: 20%  DB_VOLTAGE: 10V  [SMD_0402_CAPC1005X70N]  (hidden comment: C)
C120  DB_VALUE: 100nF  DB_TOLERANCE: 5%  DB_VOLTAGE: 16V  [SMD_0603_CAPC1608X95N]  (hidden comment: C)
C121  DB_VALUE: 10uF  DB_TOLERANCE: 20%  DB_VOLTAGE: 10V  [SMD_0402_CAPC1005X70N]  (hidden comment: C)
C122  DB_VALUE: 10uF  DB_TOLERANCE: 20%  DB_VOLTAGE: 10V  [SMD_0402_CAPC1005X70N]  (hidden comment: C)
C123  DB_VALUE: 10uF  DB_TOLERANCE: 20%  DB_VOLTAGE: 10V  [SMD_0402_CAPC1005X70N]  (hidden comment: C)
C124  DB_VALUE: 10uF  DB_TOLERANCE: 20%  DB_VOLTAGE: 10V  [SMD_0402_CAPC1005X70N]  (hidden comment: C)
C125  DB_VALUE: 10uF  DB_TOLERANCE: 20%  DB_VOLTAGE: 10V  [SMD_0402_CAPC1005X70N]  (hidden comment: C)
C126  DB_VALUE: 10uF  DB_TOLERANCE: 20%  DB_VOLTAGE: 10V  [SMD_0402_CAPC1005X70N]  (hidden comment: C)
C127  DB_VALUE: 10uF  DB_TOLERANCE: 20%  DB_VOLTAGE: 10V  [SMD_0402_CAPC1005X70N]  (hidden comment: C)
C128  DB_VALUE: 10uF  DB_TOLERANCE: 20%  DB_VOLTAGE: 10V  [SMD_0402_CAPC1005X70N]  (hidden comment: C)
C129  DB_VALUE: 10uF  DB_TOLERANCE: 20%  DB_VOLTAGE: 10V  [SMD_0402_CAPC1005X70N]  (hidden comment: C)
C130  DB_VALUE: 10uF  DB_TOLERANCE: 20%  DB_VOLTAGE: 10V  [SMD_0402_CAPC1005X70N]  (hidden comment: C)
C131  DB_VALUE: 10uF  DB_TOLERANCE: 20%  DB_VOLTAGE: 10V  [SMD_0402_CAPC1005X70N]  (hidden comment: C)
C132  DB_VALUE: 10uF  DB_TOLERANCE: 20%  DB_VOLTAGE: 10V  [SMD_0402_CAPC1005X70N]  (hidden comment: C)
C133  DB_VALUE: 10uF  DB_TOLERANCE: 20%  DB_VOLTAGE: 10V  [SMD_0402_CAPC1005X70N]  (hidden comment: C)
C134  DB_VALUE: 10uF  DB_TOLERANCE: 20%  DB_VOLTAGE: 10V  [SMD_0402_CAPC1005X70N]  (hidden comment: C)
C135  DB_VALUE: 10uF  DB_TOLERANCE: 20%  DB_VOLTAGE: 10V  [SMD_0402_CAPC1005X70N]  (hidden comment: C)
C136  DB_VALUE: 10uF  DB_TOLERANCE: 20%  DB_VOLTAGE: 10V  [SMD_0402_CAPC1005X70N]  (hidden comment: C)
C137  DB_VALUE: 10uF  DB_TOLERANCE: 20%  DB_VOLTAGE: 10V  [SMD_0402_CAPC1005X70N]  (hidden comment: C)
C138  DB_VALUE: 10uF  DB_TOLERANCE: 20%  DB_VOLTAGE: 10V  [SMD_0402_CAPC1005X70N]  (hidden comment: C)
U13  IC_BITFURY16  [SMD_QFN50P600X600X175-36AN]  (value not drawn)
U14  IC_BITFURY16  [SMD_QFN50P600X600X175-36AN]  (value not drawn)
U15  IC_BITFURY16  [SMD_QFN50P600X600X175-36AN]  (value not drawn)
U16  IC_BITFURY16  [SMD_QFN50P600X600X175-36AN]  (value not drawn)
U17  IC_BITFURY16  [SMD_QFN50P600X600X175-36AN]  (value not drawn)
U18  IC_BITFURY16  [SMD_QFN50P600X600X175-36AN]  (value not drawn)
U19  IC_BITFURY16  [SMD_QFN50P600X600X175-36AN]  (value not drawn)
U20  IC_BITFURY16  [SMD_QFN50P600X600X175-36AN]  (value not drawn)
U21  IC_BTC250  [SMD_QFN40P500X500X80-41N]  (value not drawn)
U22  IC_BITFURY16  [SMD_QFN50P600X600X175-36AN]  (value not drawn)
U23  IC_BITFURY16  [SMD_QFN50P600X600X175-36AN]  (value not drawn)
U24  IC_BITFURY16  [SMD_QFN50P600X600X175-36AN]  (value not drawn)

### Ports
GND, PAR_1, PWR11, RX0_1, RX1_1, RX2_1, TX0_1, TX1_1, TX2_1

### Nets
BF_CLK0: U13.22(SCK) U21.10(C_0)
BF_CLK1: U14.22(SCK) U21.7(C_1)
BF_CLK2: U15.22(SCK) U21.4(C_2)
BF_CLK3: U16.22(SCK) U21.1(C_3)
BF_CLK4: U17.22(SCK) U21.38(C_4)
BF_CLK5: U18.22(SCK) U21.35(C_5)
BF_CLK6: U19.22(SCK) U21.32(C_6)
BF_CLK7: U20.22(SCK) U21.29(C_7)
BF_CLK8: U21.26(C_8) U22.22(SCK)
BF_CLK9: U21.23(C_9) U23.22(SCK)
BF_CLK10: U21.20(C_10) U24.22(SCK)
BF_DAT0: U13.23(SDATA) U21.9(D_0)
BF_DAT1: U14.23(SDATA) U21.6(D_1)
BF_DAT2: U15.23(SDATA) U21.3(D_2)
BF_DAT3: U16.23(SDATA) U21.40(D_3)
BF_DAT4: U17.23(SDATA) U21.37(D_4)
BF_DAT5: U18.23(SDATA) U21.34(D_5)
BF_DAT6: U19.23(SDATA) U21.31(D_6)
BF_DAT7: U20.23(SDATA) U21.28(D_7)
BF_DAT8: U21.25(D_8) U22.23(SDATA)
BF_DAT9: U21.22(D_9) U23.23(SDATA)
BF_DAT10: U21.19(D_10) U24.23(SDATA)
CLK_PAR: U21.18(PARITY) ; port PAR_1
GND: C72.2 C73.2 C74.2 C84.2 C85.2 C86.2 C120.2 U13.36(EP) U21.41(VSS) ; port GND
MISO_TX0: U21.11(TX_0) ; port TX0_1
MOSI_RX0: U21.12(RX_0) ; port RX0_1
PWR1: C72.1 C73.1 C74.1 C75.2 C76.2 C77.2 C84.1 C85.1 C86.1 C87.2 C88.2 C89.2 U13.1(VDD) U13.2(VDD) U13.3(VDD) U13.4(VDD) U13.5(VDD) U13.6(VDD) U13.7(VDD) U13.8(VDD) U13.9(VDD) U13.10(VDD) U13.11(VDD) U13.12(VDD) U13.13(VDD) U13.14(VDD) U13.15(VDD) U13.16(VDD) U13.17(VDD) U13.18(VDD) U13.19(VDD) U13.20(VDD) U13.21(VDD) U13.24(VDD) U13.25(VDD) U13.26(VDD) U13.27(VDD) U13.28(VDD) U13.29(VDD) U13.30(VDD) U13.31(VDD) U13.32(VDD) U13.33(VDD) U13.34(VDD) U13.35(VDD) U14.36(EP) U21.8(V_0)
PWR2: C75.1 C76.1 C77.1 C78.2 C79.2 C80.2 C87.1 C88.1 C89.1 C90.2 C91.2 C92.2 U14.1(VDD) U14.2(VDD) U14.3(VDD) U14.4(VDD) U14.5(VDD) U14.6(VDD) U14.7(VDD) U14.8(VDD) U14.9(VDD) U14.10(VDD) U14.11(VDD) U14.12(VDD) U14.13(VDD) U14.14(VDD) U14.15(VDD) U14.16(VDD) U14.17(VDD) U14.18(VDD) U14.19(VDD) U14.20(VDD) U14.21(VDD) U14.24(VDD) U14.25(VDD) U14.26(VDD) U14.27(VDD) U14.28(VDD) U14.29(VDD) U14.30(VDD) U14.31(VDD) U14.32(VDD) U14.33(VDD) U14.34(VDD) U14.35(VDD) U15.36(EP) U21.5(V_1)
PWR3: C78.1 C79.1 C80.1 C81.2 C82.2 C83.2 C90.1 C91.1 C92.1 C93.2 C94.2 C95.2 U15.1(VDD) U15.2(VDD) U15.3(VDD) U15.4(VDD) U15.5(VDD) U15.6(VDD) U15.7(VDD) U15.8(VDD) U15.9(VDD) U15.10(VDD) U15.11(VDD) U15.12(VDD) U15.13(VDD) U15.14(VDD) U15.15(VDD) U15.16(VDD) U15.17(VDD) U15.18(VDD) U15.19(VDD) U15.20(VDD) U15.21(VDD) U15.24(VDD) U15.25(VDD) U15.26(VDD) U15.27(VDD) U15.28(VDD) U15.29(VDD) U15.30(VDD) U15.31(VDD) U15.32(VDD) U15.33(VDD) U15.34(VDD) U15.35(VDD) U16.36(EP) U21.2(V_2)
PWR4: C81.1 C82.1 C83.1 C93.1 C94.1 C95.1 C96.2 C97.2 C98.2 C108.2 C109.2 C110.2 U16.1(VDD) U16.2(VDD) U16.3(VDD) U16.4(VDD) U16.5(VDD) U16.6(VDD) U16.7(VDD) U16.8(VDD) U16.9(VDD) U16.10(VDD) U16.11(VDD) U16.12(VDD) U16.13(VDD) U16.14(VDD) U16.15(VDD) U16.16(VDD) U16.17(VDD) U16.18(VDD) U16.19(VDD) U16.20(VDD) U16.21(VDD) U16.24(VDD) U16.25(VDD) U16.26(VDD) U16.27(VDD) U16.28(VDD) U16.29(VDD) U16.30(VDD) U16.31(VDD) U16.32(VDD) U16.33(VDD) U16.34(VDD) U16.35(VDD) U17.36(EP) U21.39(V_3)
PWR5: C96.1 C97.1 C98.1 C99.2 C100.2 C101.2 C108.1 C109.1 C110.1 C111.2 C112.2 C113.2 U17.1(VDD) U17.2(VDD) U17.3(VDD) U17.4(VDD) U17.5(VDD) U17.6(VDD) U17.7(VDD) U17.8(VDD) U17.9(VDD) U17.10(VDD) U17.11(VDD) U17.12(VDD) U17.13(VDD) U17.14(VDD) U17.15(VDD) U17.16(VDD) U17.17(VDD) U17.18(VDD) U17.19(VDD) U17.20(VDD) U17.21(VDD) U17.24(VDD) U17.25(VDD) U17.26(VDD) U17.27(VDD) U17.28(VDD) U17.29(VDD) U17.30(VDD) U17.31(VDD) U17.32(VDD) U17.33(VDD) U17.34(VDD) U17.35(VDD) U18.36(EP) U21.36(V_4)
PWR6: C99.1 C100.1 C101.1 C102.2 C103.2 C104.2 C111.1 C112.1 C113.1 C114.2 C115.2 C116.2 U18.1(VDD) U18.2(VDD) U18.3(VDD) U18.4(VDD) U18.5(VDD) U18.6(VDD) U18.7(VDD) U18.8(VDD) U18.9(VDD) U18.10(VDD) U18.11(VDD) U18.12(VDD) U18.13(VDD) U18.14(VDD) U18.15(VDD) U18.16(VDD) U18.17(VDD) U18.18(VDD) U18.19(VDD) U18.20(VDD) U18.21(VDD) U18.24(VDD) U18.25(VDD) U18.26(VDD) U18.27(VDD) U18.28(VDD) U18.29(VDD) U18.30(VDD) U18.31(VDD) U18.32(VDD) U18.33(VDD) U18.34(VDD) U18.35(VDD) U19.36(EP) U21.33(V_5)
PWR7: C102.1 C103.1 C104.1 C105.2 C106.2 C107.2 C114.1 C115.1 C116.1 C117.2 C118.2 C119.2 U19.1(VDD) U19.2(VDD) U19.3(VDD) U19.4(VDD) U19.5(VDD) U19.6(VDD) U19.7(VDD) U19.8(VDD) U19.9(VDD) U19.10(VDD) U19.11(VDD) U19.12(VDD) U19.13(VDD) U19.14(VDD) U19.15(VDD) U19.16(VDD) U19.17(VDD) U19.18(VDD) U19.19(VDD) U19.20(VDD) U19.21(VDD) U19.24(VDD) U19.25(VDD) U19.26(VDD) U19.27(VDD) U19.28(VDD) U19.29(VDD) U19.30(VDD) U19.31(VDD) U19.32(VDD) U19.33(VDD) U19.34(VDD) U19.35(VDD) U20.36(EP) U21.30(V_6)
PWR8: C105.1 C106.1 C107.1 C117.1 C118.1 C119.1 C121.2 C122.2 C123.2 C130.2 C131.2 C132.2 U20.1(VDD) U20.2(VDD) U20.3(VDD) U20.4(VDD) U20.5(VDD) U20.6(VDD) U20.7(VDD) U20.8(VDD) U20.9(VDD) U20.10(VDD) U20.11(VDD) U20.12(VDD) U20.13(VDD) U20.14(VDD) U20.15(VDD) U20.16(VDD) U20.17(VDD) U20.18(VDD) U20.19(VDD) U20.20(VDD) U20.21(VDD) U20.24(VDD) U20.25(VDD) U20.26(VDD) U20.27(VDD) U20.28(VDD) U20.29(VDD) U20.30(VDD) U20.31(VDD) U20.32(VDD) U20.33(VDD) U20.34(VDD) U20.35(VDD) U21.27(V_7) U22.36(EP)
PWR9: C121.1 C122.1 C123.1 C124.2 C125.2 C126.2 C130.1 C131.1 C132.1 C133.2 C134.2 C135.2 U21.24(V_8) U22.1(VDD) U22.2(VDD) U22.3(VDD) U22.4(VDD) U22.5(VDD) U22.6(VDD) U22.7(VDD) U22.8(VDD) U22.9(VDD) U22.10(VDD) U22.11(VDD) U22.12(VDD) U22.13(VDD) U22.14(VDD) U22.15(VDD) U22.16(VDD) U22.17(VDD) U22.18(VDD) U22.19(VDD) U22.20(VDD) U22.21(VDD) U22.24(VDD) U22.25(VDD) U22.26(VDD) U22.27(VDD) U22.28(VDD) U22.29(VDD) U22.30(VDD) U22.31(VDD) U22.32(VDD) U22.33(VDD) U22.34(VDD) U22.35(VDD) U23.36(EP)
PWR10: C124.1 C125.1 C126.1 C127.2 C128.2 C129.2 C133.1 C134.1 C135.1 C136.2 C137.2 C138.2 U21.21(V_9) U23.1(VDD) U23.2(VDD) U23.3(VDD) U23.4(VDD) U23.5(VDD) U23.6(VDD) U23.7(VDD) U23.8(VDD) U23.9(VDD) U23.10(VDD) U23.11(VDD) U23.12(VDD) U23.13(VDD) U23.14(VDD) U23.15(VDD) U23.16(VDD) U23.17(VDD) U23.18(VDD) U23.19(VDD) U23.20(VDD) U23.21(VDD) U23.24(VDD) U23.25(VDD) U23.26(VDD) U23.27(VDD) U23.28(VDD) U23.29(VDD) U23.30(VDD) U23.31(VDD) U23.32(VDD) U23.33(VDD) U23.34(VDD) U23.35(VDD) U24.36(EP)
PWR11: C120.1 C127.1 C128.1 C129.1 C136.1 C137.1 C138.1 U21.17(VDD) U24.1(VDD) U24.2(VDD) U24.3(VDD) U24.4(VDD) U24.5(VDD) U24.6(VDD) U24.7(VDD) U24.8(VDD) U24.9(VDD) U24.10(VDD) U24.11(VDD) U24.12(VDD) U24.13(VDD) U24.14(VDD) U24.15(VDD) U24.16(VDD) U24.17(VDD) U24.18(VDD) U24.19(VDD) U24.20(VDD) U24.21(VDD) U24.24(VDD) U24.25(VDD) U24.26(VDD) U24.27(VDD) U24.28(VDD) U24.29(VDD) U24.30(VDD) U24.31(VDD) U24.32(VDD) U24.33(VDD) U24.34(VDD) U24.35(VDD) ; port PWR11
RX1_1: U21.14(RX_1) ; port RX1_1
RX2_1: U21.16(RX_2) ; port RX2_1
TX1_1: U21.13(TX_1) ; port TX1_1
TX2_1: U21.15(TX_2) ; port TX2_1

### Notes on the sheet
- Block Name
- Document Type: Schematic
- Size
- File Name
- Variant
- Rev.
- Project Name
- Sheet
- /

### Library data of the parts
C72-C119 C121-C138 = CAP000047481: DB_PART_TYPE: Ceramic_SMD\Standard_X5R; DB_MANUFACTURER_PART: SAMSUNG    CL05A106MP5NUNC; NOTE: <NOTE>; DB_T_RANGE: -55 to 85; DB_PACKAGE: 0402; DB_DESCRIPTION: C X5R 10uF 20% 10V 0402; DB_APPROVED_BY: VSN; DB_STATUS: NEW; DB_PART_NUMBER: CAP000047481; DB_PCB_DEVICE: SMD_0402_CAPC1005X70N; DB_APPROVED_ON: 20.04.2016 14:32:27; DB_DATASHEET: http://john.epiqdesign.com/projects/CIS_Datasheets/CAP_S_CL05A106MP5NUNC.pdf?rev=2053&sc=0
C120 = CAP000027134: as C206 on sheet MCU; DB_PART_NUMBER: CAP000027134; DB_PCB_DEVICE: SMD_0603_CAPC1608X95N; DB_APPROVED_ON: 09.10.2010; DB_DATASHEET: http://john.epiqdesign.com/projects/CIS_Datasheets/F3102_CE_Kemet.pdf?rev=92&sc=0
U13-U20 U22-U24 = IC_BITFURY16: BitFury 2016 16 nm; DB_PACKAGE: FCLGA 35L 6x6mm; DB_VALUE: BF8162C16; DB_DESCRIPTION: BitFury 2016 16 nm; DB_PCB_DEVICE: SMD_QFN50P600X600X175-36AN
U21 = IC_BTC250: DB_MANUFACTURER_PART: BTC250 QFN40 EP; DB_PACKAGE: QFN40 EP; DB_VALUE: BTC250; DB_PCB_DEVICE: SMD_QFN40P500X500X80-41N

## Sheet ASIC_2.SchDoc: Title
size A2; Date: Date; CompanyName: Integrated Micro-Electronics Bulgaria; Organization: Design & Development Department; Address1: Drawing Type; Address2: Address 1; Address3: Address 2; Address4: Address 3; DocumentNumber: 730xxx; Revision: 01; SheetNumber: 1; SheetTotal: 1; PageSetup: Record=PageOptions|CenterHorizontal=True|CenterVertical=True|PrintScale=0.70|XCorrection=1.00|YCorrection=1.00|PrintKind=2|BorderSize=5000000|LeftOffset=0|BottomOffset=0|Orientation=2|PaperLength=1000|PaperWidth=1000|Scale=100|PaperSource=7|PrintQuality=-4|MediaType=1|DitherType=10|PaperKind=A4|PrintScaleMode=1; SheetSize: A3; Time: Time; ModifiedDate: Mod. Date
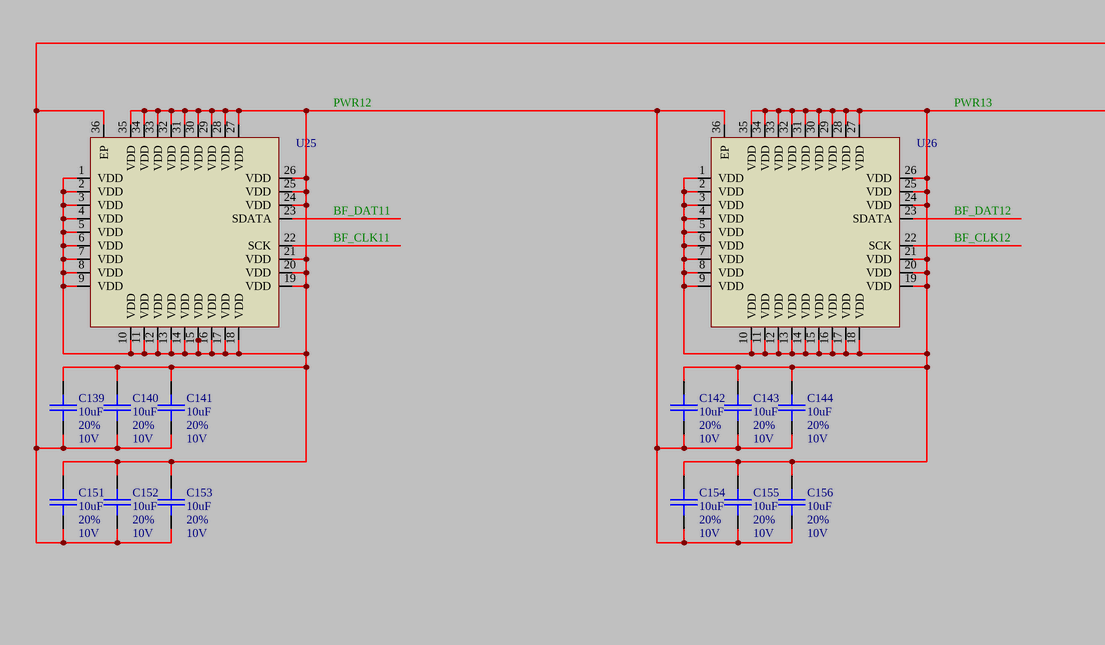
[diagram p4: ASIC_2.SchDoc, left]
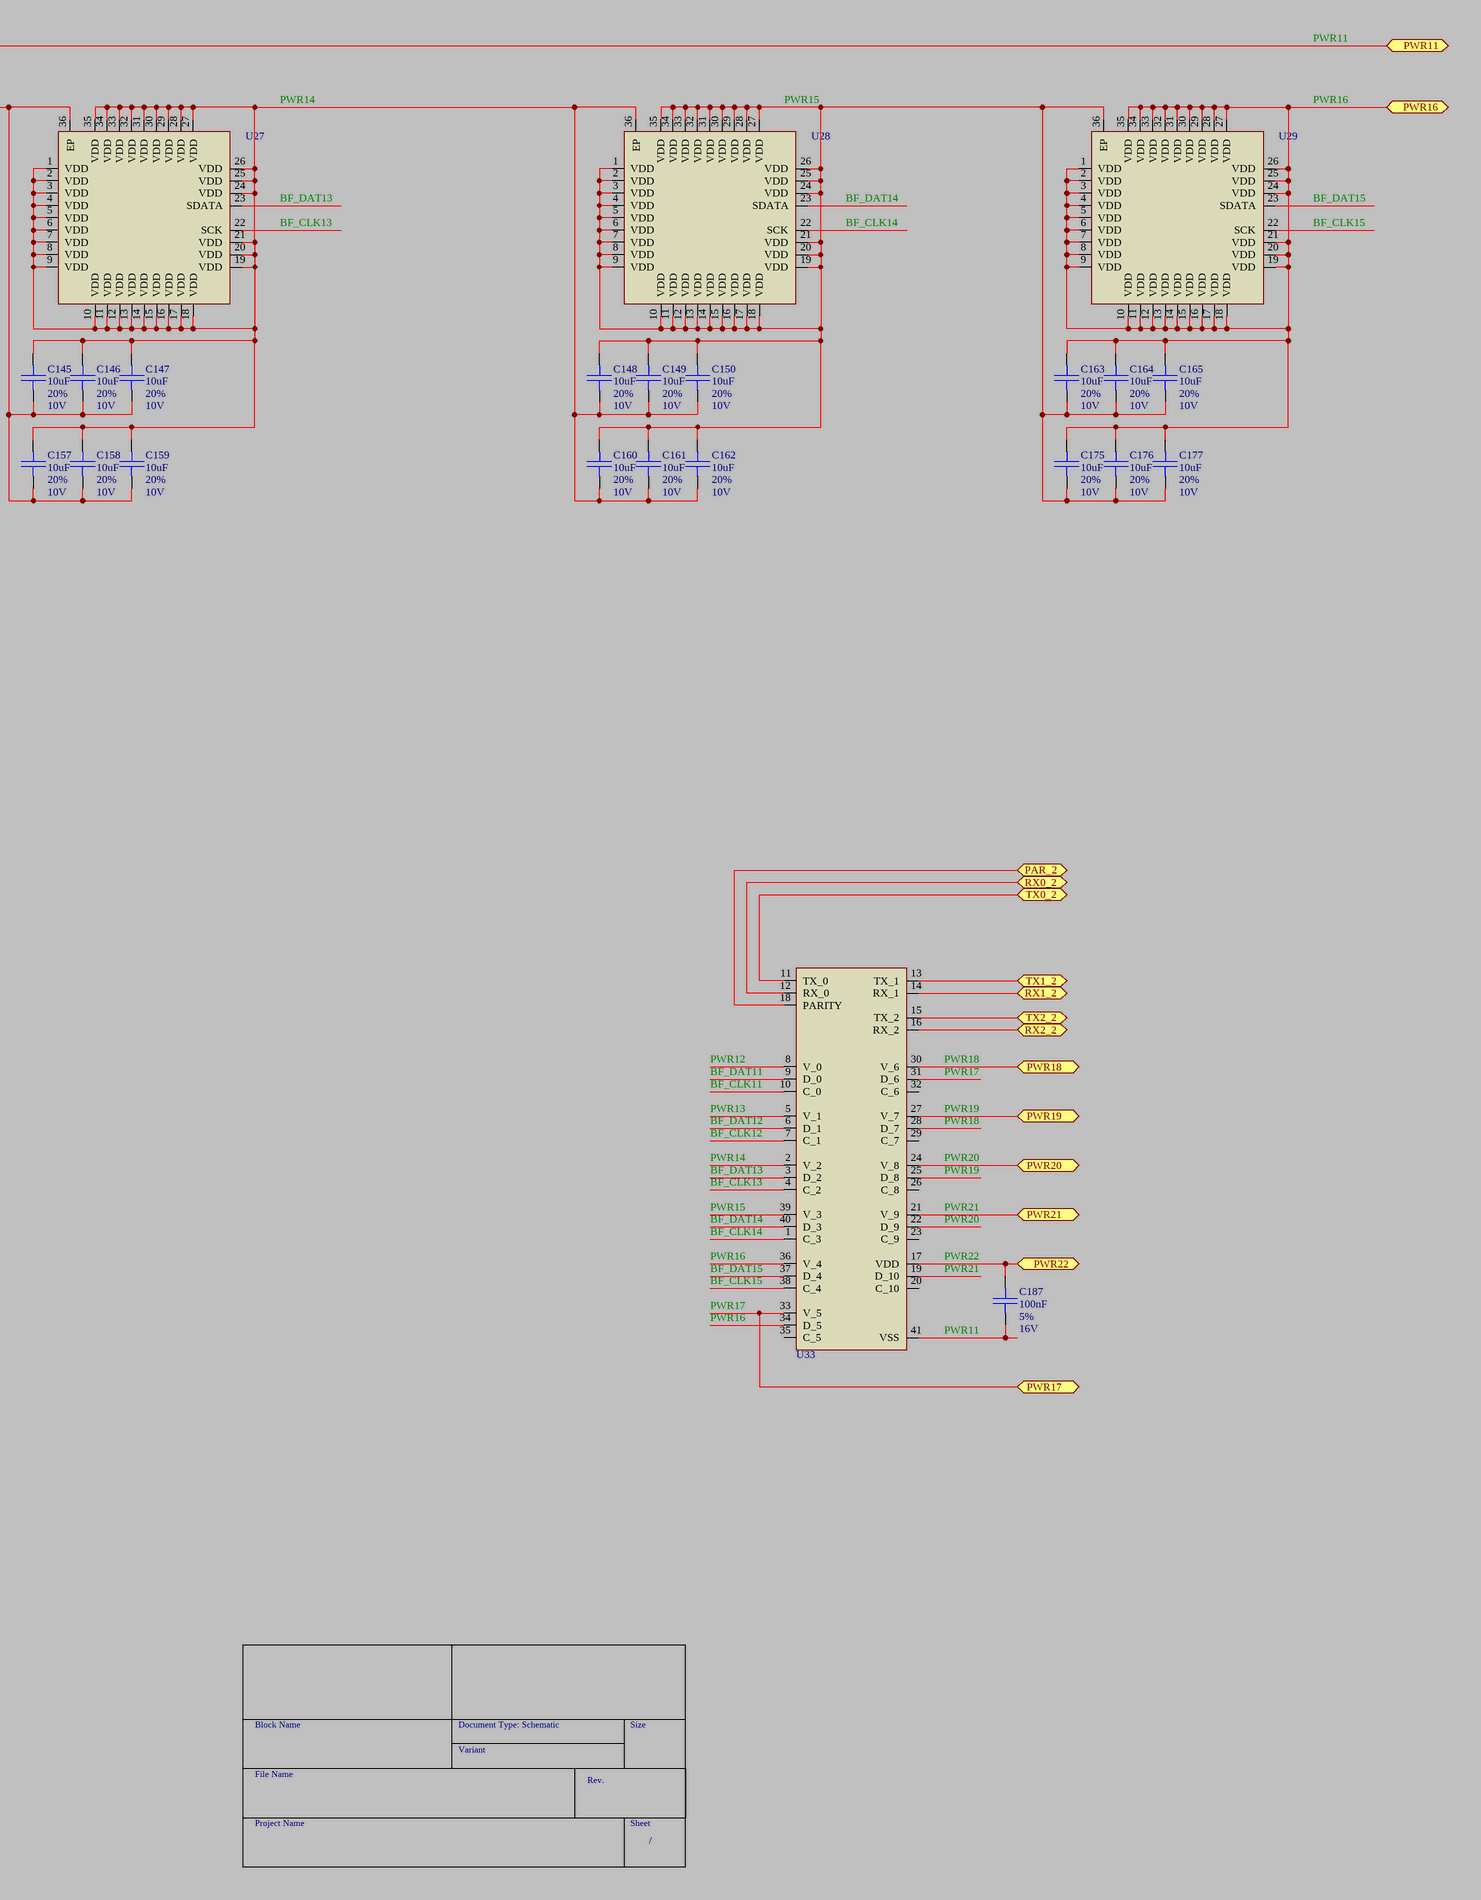
[diagram p5: ASIC_2.SchDoc, right]

### Parts
C139  DB_VALUE: 10uF  DB_TOLERANCE: 20%  DB_VOLTAGE: 10V  [SMD_0402_CAPC1005X70N]  (hidden comment: C)
C140  DB_VALUE: 10uF  DB_TOLERANCE: 20%  DB_VOLTAGE: 10V  [SMD_0402_CAPC1005X70N]  (hidden comment: C)
C141  DB_VALUE: 10uF  DB_TOLERANCE: 20%  DB_VOLTAGE: 10V  [SMD_0402_CAPC1005X70N]  (hidden comment: C)
C142  DB_VALUE: 10uF  DB_TOLERANCE: 20%  DB_VOLTAGE: 10V  [SMD_0402_CAPC1005X70N]  (hidden comment: C)
C143  DB_VALUE: 10uF  DB_TOLERANCE: 20%  DB_VOLTAGE: 10V  [SMD_0402_CAPC1005X70N]  (hidden comment: C)
C144  DB_VALUE: 10uF  DB_TOLERANCE: 20%  DB_VOLTAGE: 10V  [SMD_0402_CAPC1005X70N]  (hidden comment: C)
C145  DB_VALUE: 10uF  DB_TOLERANCE: 20%  DB_VOLTAGE: 10V  [SMD_0402_CAPC1005X70N]  (hidden comment: C)
C146  DB_VALUE: 10uF  DB_TOLERANCE: 20%  DB_VOLTAGE: 10V  [SMD_0402_CAPC1005X70N]  (hidden comment: C)
C147  DB_VALUE: 10uF  DB_TOLERANCE: 20%  DB_VOLTAGE: 10V  [SMD_0402_CAPC1005X70N]  (hidden comment: C)
C148  DB_VALUE: 10uF  DB_TOLERANCE: 20%  DB_VOLTAGE: 10V  [SMD_0402_CAPC1005X70N]  (hidden comment: C)
C149  DB_VALUE: 10uF  DB_TOLERANCE: 20%  DB_VOLTAGE: 10V  [SMD_0402_CAPC1005X70N]  (hidden comment: C)
C150  DB_VALUE: 10uF  DB_TOLERANCE: 20%  DB_VOLTAGE: 10V  [SMD_0402_CAPC1005X70N]  (hidden comment: C)
C151  DB_VALUE: 10uF  DB_TOLERANCE: 20%  DB_VOLTAGE: 10V  [SMD_0402_CAPC1005X70N]  (hidden comment: C)
C152  DB_VALUE: 10uF  DB_TOLERANCE: 20%  DB_VOLTAGE: 10V  [SMD_0402_CAPC1005X70N]  (hidden comment: C)
C153  DB_VALUE: 10uF  DB_TOLERANCE: 20%  DB_VOLTAGE: 10V  [SMD_0402_CAPC1005X70N]  (hidden comment: C)
C154  DB_VALUE: 10uF  DB_TOLERANCE: 20%  DB_VOLTAGE: 10V  [SMD_0402_CAPC1005X70N]  (hidden comment: C)
C155  DB_VALUE: 10uF  DB_TOLERANCE: 20%  DB_VOLTAGE: 10V  [SMD_0402_CAPC1005X70N]  (hidden comment: C)
C156  DB_VALUE: 10uF  DB_TOLERANCE: 20%  DB_VOLTAGE: 10V  [SMD_0402_CAPC1005X70N]  (hidden comment: C)
C157  DB_VALUE: 10uF  DB_TOLERANCE: 20%  DB_VOLTAGE: 10V  [SMD_0402_CAPC1005X70N]  (hidden comment: C)
C158  DB_VALUE: 10uF  DB_TOLERANCE: 20%  DB_VOLTAGE: 10V  [SMD_0402_CAPC1005X70N]  (hidden comment: C)
C159  DB_VALUE: 10uF  DB_TOLERANCE: 20%  DB_VOLTAGE: 10V  [SMD_0402_CAPC1005X70N]  (hidden comment: C)
C160  DB_VALUE: 10uF  DB_TOLERANCE: 20%  DB_VOLTAGE: 10V  [SMD_0402_CAPC1005X70N]  (hidden comment: C)
C161  DB_VALUE: 10uF  DB_TOLERANCE: 20%  DB_VOLTAGE: 10V  [SMD_0402_CAPC1005X70N]  (hidden comment: C)
C162  DB_VALUE: 10uF  DB_TOLERANCE: 20%  DB_VOLTAGE: 10V  [SMD_0402_CAPC1005X70N]  (hidden comment: C)
C163  DB_VALUE: 10uF  DB_TOLERANCE: 20%  DB_VOLTAGE: 10V  [SMD_0402_CAPC1005X70N]  (hidden comment: C)
C164  DB_VALUE: 10uF  DB_TOLERANCE: 20%  DB_VOLTAGE: 10V  [SMD_0402_CAPC1005X70N]  (hidden comment: C)
C165  DB_VALUE: 10uF  DB_TOLERANCE: 20%  DB_VOLTAGE: 10V  [SMD_0402_CAPC1005X70N]  (hidden comment: C)
C175  DB_VALUE: 10uF  DB_TOLERANCE: 20%  DB_VOLTAGE: 10V  [SMD_0402_CAPC1005X70N]  (hidden comment: C)
C176  DB_VALUE: 10uF  DB_TOLERANCE: 20%  DB_VOLTAGE: 10V  [SMD_0402_CAPC1005X70N]  (hidden comment: C)
C177  DB_VALUE: 10uF  DB_TOLERANCE: 20%  DB_VOLTAGE: 10V  [SMD_0402_CAPC1005X70N]  (hidden comment: C)
C187  DB_VALUE: 100nF  DB_TOLERANCE: 5%  DB_VOLTAGE: 16V  [SMD_0603_CAPC1608X95N]  (hidden comment: C)
U25  IC_BITFURY16  [SMD_QFN50P600X600X175-36AN]  (value not drawn)
U26  IC_BITFURY16  [SMD_QFN50P600X600X175-36AN]  (value not drawn)
U27  IC_BITFURY16  [SMD_QFN50P600X600X175-36AN]  (value not drawn)
U28  IC_BITFURY16  [SMD_QFN50P600X600X175-36AN]  (value not drawn)
U29  IC_BITFURY16  [SMD_QFN50P600X600X175-36AN]  (value not drawn)
U33  IC_BTC250  [SMD_QFN40P500X500X80-41N]  (value not drawn)

### Ports
PAR_2, PWR11, PWR16, PWR17, PWR18, PWR19, PWR20, PWR21, PWR22, RX0_2, RX1_2, RX2_2, TX0_2, TX1_2, TX2_2

### Nets
BF_CLK11: U25.22(SCK) U33.10(C_0)
BF_CLK12: U26.22(SCK) U33.7(C_1)
BF_CLK13: U27.22(SCK) U33.4(C_2)
BF_CLK14: U28.22(SCK) U33.1(C_3)
BF_CLK15: U29.22(SCK) U33.38(C_4)
BF_DAT11: U25.23(SDATA) U33.9(D_0)
BF_DAT12: U26.23(SDATA) U33.6(D_1)
BF_DAT13: U27.23(SDATA) U33.3(D_2)
BF_DAT14: U28.23(SDATA) U33.40(D_3)
BF_DAT15: U29.23(SDATA) U33.37(D_4)
PAR_2: U33.18(PARITY) ; port PAR_2
PWR11: C139.2 C140.2 C141.2 C151.2 C152.2 C153.2 C187.2 U25.36(EP) U33.41(VSS) ; port PWR11
PWR12: C139.1 C140.1 C141.1 C142.2 C143.2 C144.2 C151.1 C152.1 C153.1 C154.2 C155.2 C156.2 U25.1(VDD) U25.2(VDD) U25.3(VDD) U25.4(VDD) U25.5(VDD) U25.6(VDD) U25.7(VDD) U25.8(VDD) U25.9(VDD) U25.10(VDD) U25.11(VDD) U25.12(VDD) U25.13(VDD) U25.14(VDD) U25.15(VDD) U25.16(VDD) U25.17(VDD) U25.18(VDD) U25.19(VDD) U25.20(VDD) U25.21(VDD) U25.24(VDD) U25.25(VDD) U25.26(VDD) U25.27(VDD) U25.28(VDD) U25.29(VDD) U25.30(VDD) U25.31(VDD) U25.32(VDD) U25.33(VDD) U25.34(VDD) U25.35(VDD) U26.36(EP) U33.8(V_0)
PWR13: C142.1 C143.1 C144.1 C145.2 C146.2 C147.2 C154.1 C155.1 C156.1 C157.2 C158.2 C159.2 U26.1(VDD) U26.2(VDD) U26.3(VDD) U26.4(VDD) U26.5(VDD) U26.6(VDD) U26.7(VDD) U26.8(VDD) U26.9(VDD) U26.10(VDD) U26.11(VDD) U26.12(VDD) U26.13(VDD) U26.14(VDD) U26.15(VDD) U26.16(VDD) U26.17(VDD) U26.18(VDD) U26.19(VDD) U26.20(VDD) U26.21(VDD) U26.24(VDD) U26.25(VDD) U26.26(VDD) U26.27(VDD) U26.28(VDD) U26.29(VDD) U26.30(VDD) U26.31(VDD) U26.32(VDD) U26.33(VDD) U26.34(VDD) U26.35(VDD) U27.36(EP) U33.5(V_1)
PWR14: C145.1 C146.1 C147.1 C148.2 C149.2 C150.2 C157.1 C158.1 C159.1 C160.2 C161.2 C162.2 U27.1(VDD) U27.2(VDD) U27.3(VDD) U27.4(VDD) U27.5(VDD) U27.6(VDD) U27.7(VDD) U27.8(VDD) U27.9(VDD) U27.10(VDD) U27.11(VDD) U27.12(VDD) U27.13(VDD) U27.14(VDD) U27.15(VDD) U27.16(VDD) U27.17(VDD) U27.18(VDD) U27.19(VDD) U27.20(VDD) U27.21(VDD) U27.24(VDD) U27.25(VDD) U27.26(VDD) U27.27(VDD) U27.28(VDD) U27.29(VDD) U27.30(VDD) U27.31(VDD) U27.32(VDD) U27.33(VDD) U27.34(VDD) U27.35(VDD) U28.36(EP) U33.2(V_2)
PWR15: C148.1 C149.1 C150.1 C160.1 C161.1 C162.1 C163.2 C164.2 C165.2 C175.2 C176.2 C177.2 U28.1(VDD) U28.2(VDD) U28.3(VDD) U28.4(VDD) U28.5(VDD) U28.6(VDD) U28.7(VDD) U28.8(VDD) U28.9(VDD) U28.10(VDD) U28.11(VDD) U28.12(VDD) U28.13(VDD) U28.14(VDD) U28.15(VDD) U28.16(VDD) U28.17(VDD) U28.18(VDD) U28.19(VDD) U28.20(VDD) U28.21(VDD) U28.24(VDD) U28.25(VDD) U28.26(VDD) U28.27(VDD) U28.28(VDD) U28.29(VDD) U28.30(VDD) U28.31(VDD) U28.32(VDD) U28.33(VDD) U28.34(VDD) U28.35(VDD) U29.36(EP) U33.39(V_3)
PWR16: C163.1 C164.1 C165.1 C175.1 C176.1 C177.1 U29.1(VDD) U29.2(VDD) U29.3(VDD) U29.4(VDD) U29.5(VDD) U29.6(VDD) U29.7(VDD) U29.8(VDD) U29.9(VDD) U29.10(VDD) U29.11(VDD) U29.12(VDD) U29.13(VDD) U29.14(VDD) U29.15(VDD) U29.16(VDD) U29.17(VDD) U29.18(VDD) U29.19(VDD) U29.20(VDD) U29.21(VDD) U29.24(VDD) U29.25(VDD) U29.26(VDD) U29.27(VDD) U29.28(VDD) U29.29(VDD) U29.30(VDD) U29.31(VDD) U29.32(VDD) U29.33(VDD) U29.34(VDD) U29.35(VDD) U33.34(D_5) U33.36(V_4) ; port PWR16
PWR17: U33.31(D_6) U33.33(V_5) ; port PWR17
PWR18: U33.28(D_7) U33.30(V_6) ; port PWR18
PWR19: U33.25(D_8) U33.27(V_7) ; port PWR19
PWR20: U33.22(D_9) U33.24(V_8) ; port PWR20
PWR21: U33.19(D_10) U33.21(V_9) ; port PWR21
PWR22: C187.1 U33.17(VDD) ; port PWR22
RX0_2: U33.12(RX_0) ; port RX0_2
RX1_2: U33.14(RX_1) ; port RX1_2
RX2_2: U33.16(RX_2) ; port RX2_2
TX0_2: U33.11(TX_0) ; port TX0_2
TX1_2: U33.13(TX_1) ; port TX1_2
TX2_2: U33.15(TX_2) ; port TX2_2

Not connected (* = marked no-connect by the designer): U33 20(C_10) 23(C_9) 26(C_8) 29(C_7) 32(C_6) 35(C_5)

### Notes on the sheet
- Block Name
- Document Type: Schematic
- Size
- File Name
- Variant
- Rev.
- Project Name
- Sheet
- /

### Library data of the parts
C139-C165 C175-C177 = CAP000047481: as C72 on sheet ASIC_1; DB_PART_NUMBER: CAP000047481; DB_PCB_DEVICE: SMD_0402_CAPC1005X70N; DB_APPROVED_ON: 20.04.2016 14:32:27; DB_DATASHEET: http://john.epiqdesign.com/projects/CIS_Datasheets/CAP_S_CL05A106MP5NUNC.pdf?rev=2053&sc=0
C187 = CAP000027134: as C206 on sheet MCU; DB_PART_NUMBER: CAP000027134; DB_PCB_DEVICE: SMD_0603_CAPC1608X95N; DB_APPROVED_ON: 09.10.2010; DB_DATASHEET: http://john.epiqdesign.com/projects/CIS_Datasheets/F3102_CE_Kemet.pdf?rev=92&sc=0
U25-U29 = IC_BITFURY16: as U13 on sheet ASIC_1; DB_DESCRIPTION: BitFury 2016 16 nm; DB_PCB_DEVICE: SMD_QFN50P600X600X175-36AN
U33 = IC_BTC250: as U21 on sheet ASIC_1; DB_PCB_DEVICE: SMD_QFN40P500X500X80-41N